# EAGLE design LED_Ansteuerung (EAGLE 5.09)

## Sheet 1 of 6
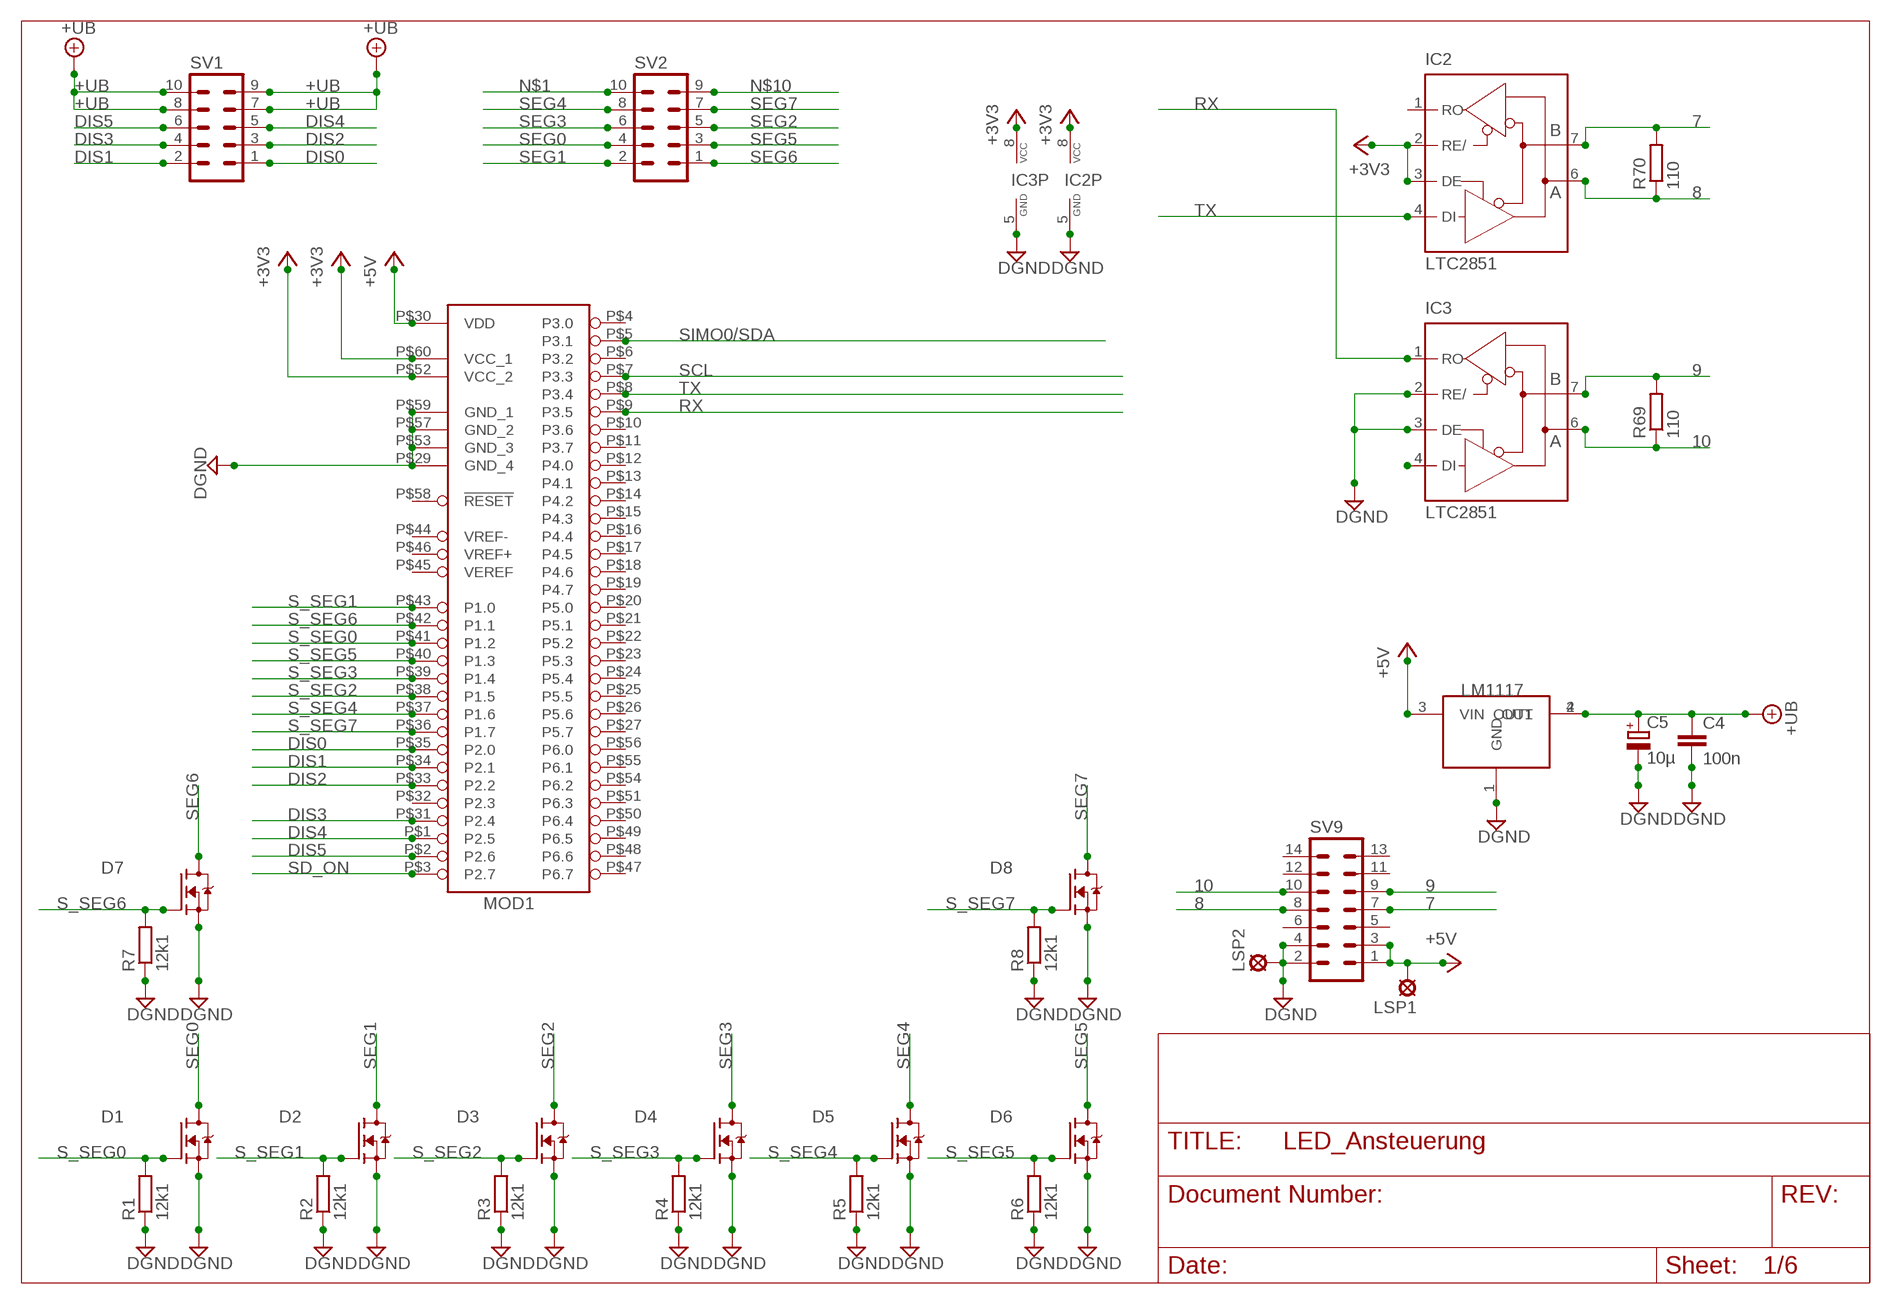
[diagram p0: schematic, sheet 1]

### Parts
C4  100n  C-EUC0805  [C0805]
C5  10µ  CPOL-EU153CLV-0505  [153CLV-0505]
D1  FDV303  [SOT23]
D2  FDV303  [SOT23]
D3  FDV303  [SOT23]
D4  FDV303  [SOT23]
D5  FDV303  [SOT23]
D6  FDV303  [SOT23]
D7  FDV303  [SOT23]
D8  FDV303  [SOT23]
IC1  LM1117  [SOT223]
IC2  LTC2851  MAX481CSA  [SO08]
IC3  LTC2851  MAX481CSA  [SO08]
LSP1  MCS10B  [MCS10B]
LSP2  MCS10B  [MCS10B]
MOD1  MOD_MSP430F16X  [MOD_MSDP430F16X]
R1  12k1  R-EU_R0805  [R0805]
R2  12k1  R-EU_R0805  [R0805]
R3  12k1  R-EU_R0805  [R0805]
R4  12k1  R-EU_R0805  [R0805]
R5  12k1  R-EU_R0805  [R0805]
R6  12k1  R-EU_R0805  [R0805]
R7  12k1  R-EU_R0805  [R0805]
R8  12k1  R-EU_R0805  [R0805]
R69  110  R-EU_R1206  [R1206]
R70  110  R-EU_R1206  [R1206]
SV1  ML10  [ML10]
SV2  ML10  [ML10]
SV9  ML14  [ML14]

### Nets
7: IC2.7(B) R70.2 SV9.7
8: IC2.6(A) R70.1 SV9.8
9: IC3.7(B) R69.2 SV9.9
10: IC3.6(A) R69.1 SV9.10
+3V3: IC2.2(RE/) IC2.3(DE) IC2.8(VCC) IC3.8(VCC) MOD1.P$52(VCC_2) MOD1.P$60(VCC_1) ; also sheet 2,3,4,5
+5V: IC1.3(VIN) LSP1.MP MOD1.P$30(VDD) SV9.1 SV9.3
+UB: C4.1 C5.+ IC1.2(OUT) IC1.4(OUT1) SV1.7 SV1.8 SV1.9 SV1.10
DGND: C4.2 C5.- D1.2(S) D2.2(S) D3.2(S) D4.2(S) D5.2(S) D6.2(S) D7.2(S) D8.2(S) IC1.1(GND) IC2.5(GND) IC3.2(RE/) IC3.3(DE) IC3.5(GND) LSP2.MP MOD1.P$29(GND_4) MOD1.P$53(GND_3) MOD1.P$57(GND_2) MOD1.P$59(GND_1) R1.1 R2.1 R3.1 R4.1 R5.1 R6.1 R7.1 R8.1 SV9.2 SV9.4 ; also sheet 2,3,4,5
DIS0: MOD1.P$35(P2.0) SV1.1
DIS1: MOD1.P$34(P2.1) SV1.2
DIS2: MOD1.P$33(P2.2) SV1.3
DIS3: MOD1.P$31(P2.4) SV1.4
DIS4: MOD1.P$1(P2.5) SV1.5
DIS5: MOD1.P$2(P2.6) SV1.6
N$1: SV2.10
N$10: SV2.9
N$35: IC3.4(DI)
RX: IC3.1(RO) MOD1.P$9(P3.5)
S_SEG0: D1.1(G) MOD1.P$41(P1.2) R1.2
S_SEG1: D2.1(G) MOD1.P$43(P1.0) R2.2
S_SEG2: D3.1(G) MOD1.P$38(P1.5) R3.2
S_SEG3: D4.1(G) MOD1.P$39(P1.4) R4.2
S_SEG4: D5.1(G) MOD1.P$37(P1.6) R5.2
S_SEG5: D6.1(G) MOD1.P$40(P1.3) R6.2
S_SEG6: D7.1(G) MOD1.P$42(P1.1) R7.2
S_SEG7: D8.1(G) MOD1.P$36(P1.7) R8.2
SCL: MOD1.P$7(P3.3) ; also sheet 2,3,4,5
SD_ON: MOD1.P$3(P2.7)
SEG0: D1.3(D) SV2.4
SEG1: D2.3(D) SV2.2
SEG2: D3.3(D) SV2.5
SEG3: D4.3(D) SV2.6
SEG4: D5.3(D) SV2.8
SEG5: D6.3(D) SV2.3
SEG6: D7.3(D) SV2.1
SEG7: D8.3(D) SV2.7
SIMO0/SDA: MOD1.P$5(P3.1) ; also sheet 2,3,4,5
TX: IC2.4(DI) MOD1.P$8(P3.4)
Unconnected: IC2.1(RO) MOD1.P$4(P3.0) MOD1.P$6(P3.2) MOD1.P$10(P3.6) MOD1.P$11(P3.7) MOD1.P$12(P4.0) MOD1.P$13(P4.1) MOD1.P$14(P4.2) MOD1.P$15(P4.3) MOD1.P$16(P4.4) MOD1.P$17(P4.5) MOD1.P$18(P4.6) MOD1.P$19(P4.7) MOD1.P$20(P5.0) MOD1.P$21(P5.1) MOD1.P$22(P5.2) MOD1.P$23(P5.3) MOD1.P$24(P5.4) MOD1.P$25(P5.5) MOD1.P$26(P5.6) MOD1.P$27(P5.7) MOD1.P$32(P2.3) MOD1.P$44(VREF-) MOD1.P$45(VEREF) MOD1.P$46(VREF+) MOD1.P$47(P6.7) MOD1.P$48(P6.6) MOD1.P$49(P6.5) MOD1.P$50(P6.4) MOD1.P$51(P6.3) MOD1.P$54(P6.2) MOD1.P$55(P6.1) MOD1.P$56(P6.0) MOD1.P$58(!RESET) SV9.5 SV9.6 SV9.11 SV9.12 SV9.13 SV9.14

## Sheet 2 of 6
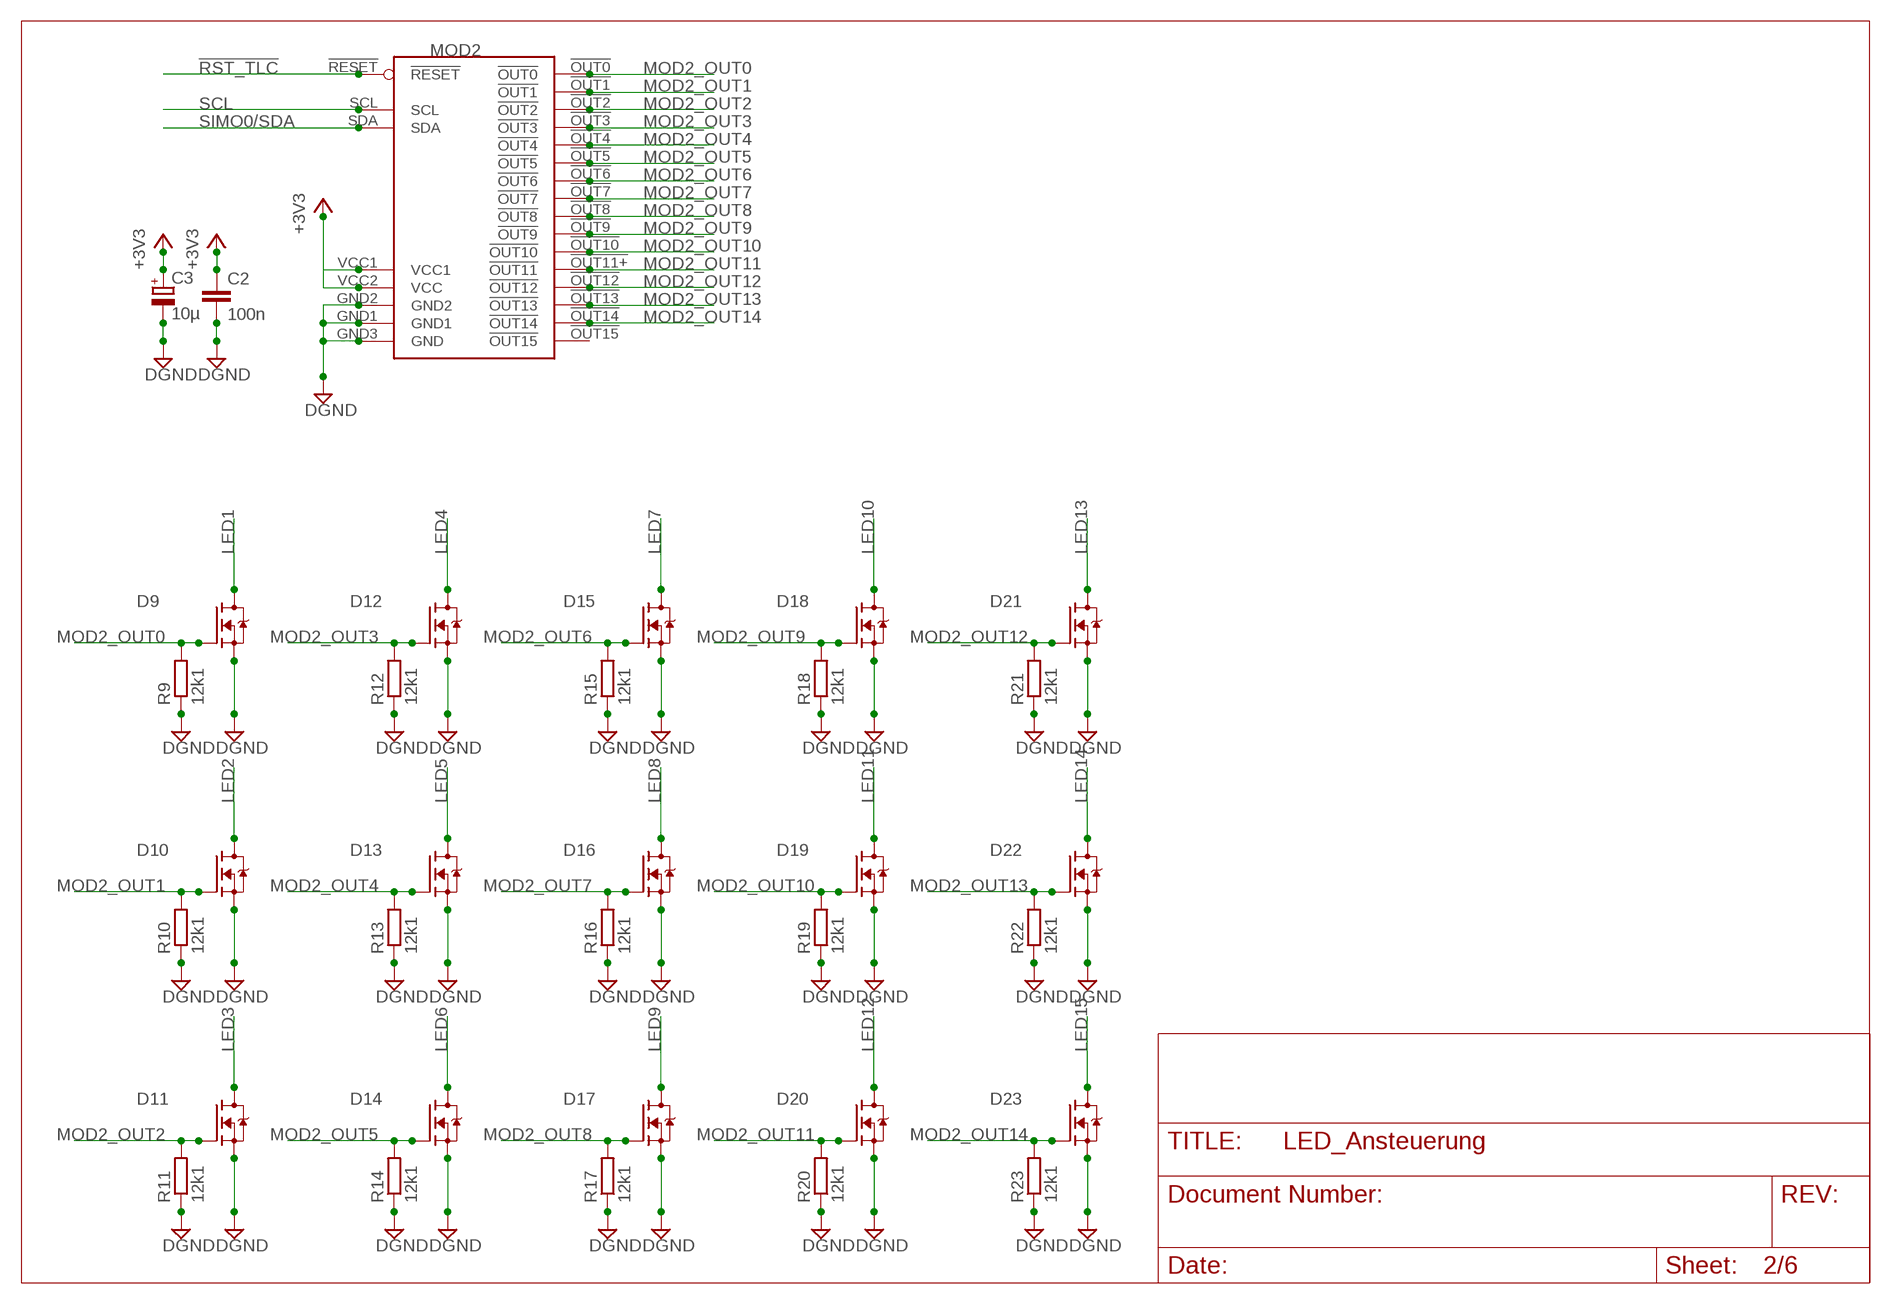
[diagram p1: schematic, sheet 2]

### Parts
C2  100n  C-EUC0805  [C0805]
C3  10µ  CPOL-EU153CLV-0505  [153CLV-0505]
D9  FDV303  [SOT23]
D10  FDV303  [SOT23]
D11  FDV303  [SOT23]
D12  FDV303  [SOT23]
D13  FDV303  [SOT23]
D14  FDV303  [SOT23]
D15  FDV303  [SOT23]
D16  FDV303  [SOT23]
D17  FDV303  [SOT23]
D18  FDV303  [SOT23]
D19  FDV303  [SOT23]
D20  FDV303  [SOT23]
D21  FDV303  [SOT23]
D22  FDV303  [SOT23]
D23  FDV303  [SOT23]
MOD2  TLC59116_MOD  [TLC59116_MOD]
R9  12k1  R-EU_R0805  [R0805]
R10  12k1  R-EU_R0805  [R0805]
R11  12k1  R-EU_R0805  [R0805]
R12  12k1  R-EU_R0805  [R0805]
R13  12k1  R-EU_R0805  [R0805]
R14  12k1  R-EU_R0805  [R0805]
R15  12k1  R-EU_R0805  [R0805]
R16  12k1  R-EU_R0805  [R0805]
R17  12k1  R-EU_R0805  [R0805]
R18  12k1  R-EU_R0805  [R0805]
R19  12k1  R-EU_R0805  [R0805]
R20  12k1  R-EU_R0805  [R0805]
R21  12k1  R-EU_R0805  [R0805]
R22  12k1  R-EU_R0805  [R0805]
R23  12k1  R-EU_R0805  [R0805]

### Nets
!RST_TLC: MOD2.!RESET ; also sheet 3,4,5
+3V3: C2.1 C3.+ MOD2.VCC1 MOD2.VCC2(VCC) ; also sheet 1,3,4,5
DGND: C2.2 C3.- D9.2(S) D10.2(S) D11.2(S) D12.2(S) D13.2(S) D14.2(S) D15.2(S) D16.2(S) D17.2(S) D18.2(S) D19.2(S) D20.2(S) D21.2(S) D22.2(S) D23.2(S) MOD2.GND1 MOD2.GND2 MOD2.GND3(GND) R9.1 R10.1 R11.1 R12.1 R13.1 R14.1 R15.1 R16.1 R17.1 R18.1 R19.1 R20.1 R21.1 R22.1 R23.1 ; also sheet 1,3,4,5
LED1: D9.3(D) ; also sheet 6
LED2: D10.3(D) ; also sheet 6
LED3: D11.3(D) ; also sheet 6
LED4: D12.3(D) ; also sheet 6
LED5: D13.3(D) ; also sheet 6
LED6: D14.3(D) ; also sheet 6
LED7: D15.3(D) ; also sheet 6
LED8: D16.3(D) ; also sheet 6
LED9: D17.3(D) ; also sheet 6
LED10: D18.3(D) ; also sheet 6
LED11: D19.3(D) ; also sheet 6
LED12: D20.3(D) ; also sheet 6
LED13: D21.3(D) ; also sheet 6
LED14: D22.3(D) ; also sheet 6
LED15: D23.3(D) ; also sheet 6
MOD2_OUT0: D9.1(G) MOD2.!OUT0 R9.2
MOD2_OUT1: D10.1(G) MOD2.!OUT1 R10.2
MOD2_OUT2: D11.1(G) MOD2.!OUT2 R11.2
MOD2_OUT3: D12.1(G) MOD2.!OUT3 R12.2
MOD2_OUT4: D13.1(G) MOD2.!OUT4 R13.2
MOD2_OUT5: D14.1(G) MOD2.!OUT5 R14.2
MOD2_OUT6: D15.1(G) MOD2.!OUT6 R15.2
MOD2_OUT7: D16.1(G) MOD2.!OUT7 R16.2
MOD2_OUT8: D17.1(G) MOD2.!OUT8 R17.2
MOD2_OUT9: D18.1(G) MOD2.!OUT9 R18.2
MOD2_OUT10: D19.1(G) MOD2.!OUT10 R19.2
MOD2_OUT11: D20.1(G) MOD2.!OUT11+(!OUT11) R20.2
MOD2_OUT12: D21.1(G) MOD2.!OUT12 R21.2
MOD2_OUT13: D22.1(G) MOD2.!OUT13 R22.2
MOD2_OUT14: D23.1(G) MOD2.!OUT14 R23.2
SCL: MOD2.SCL ; also sheet 1,3,4,5
SIMO0/SDA: MOD2.SDA ; also sheet 1,3,4,5
Unconnected: MOD2.!OUT15

## Sheet 3 of 6
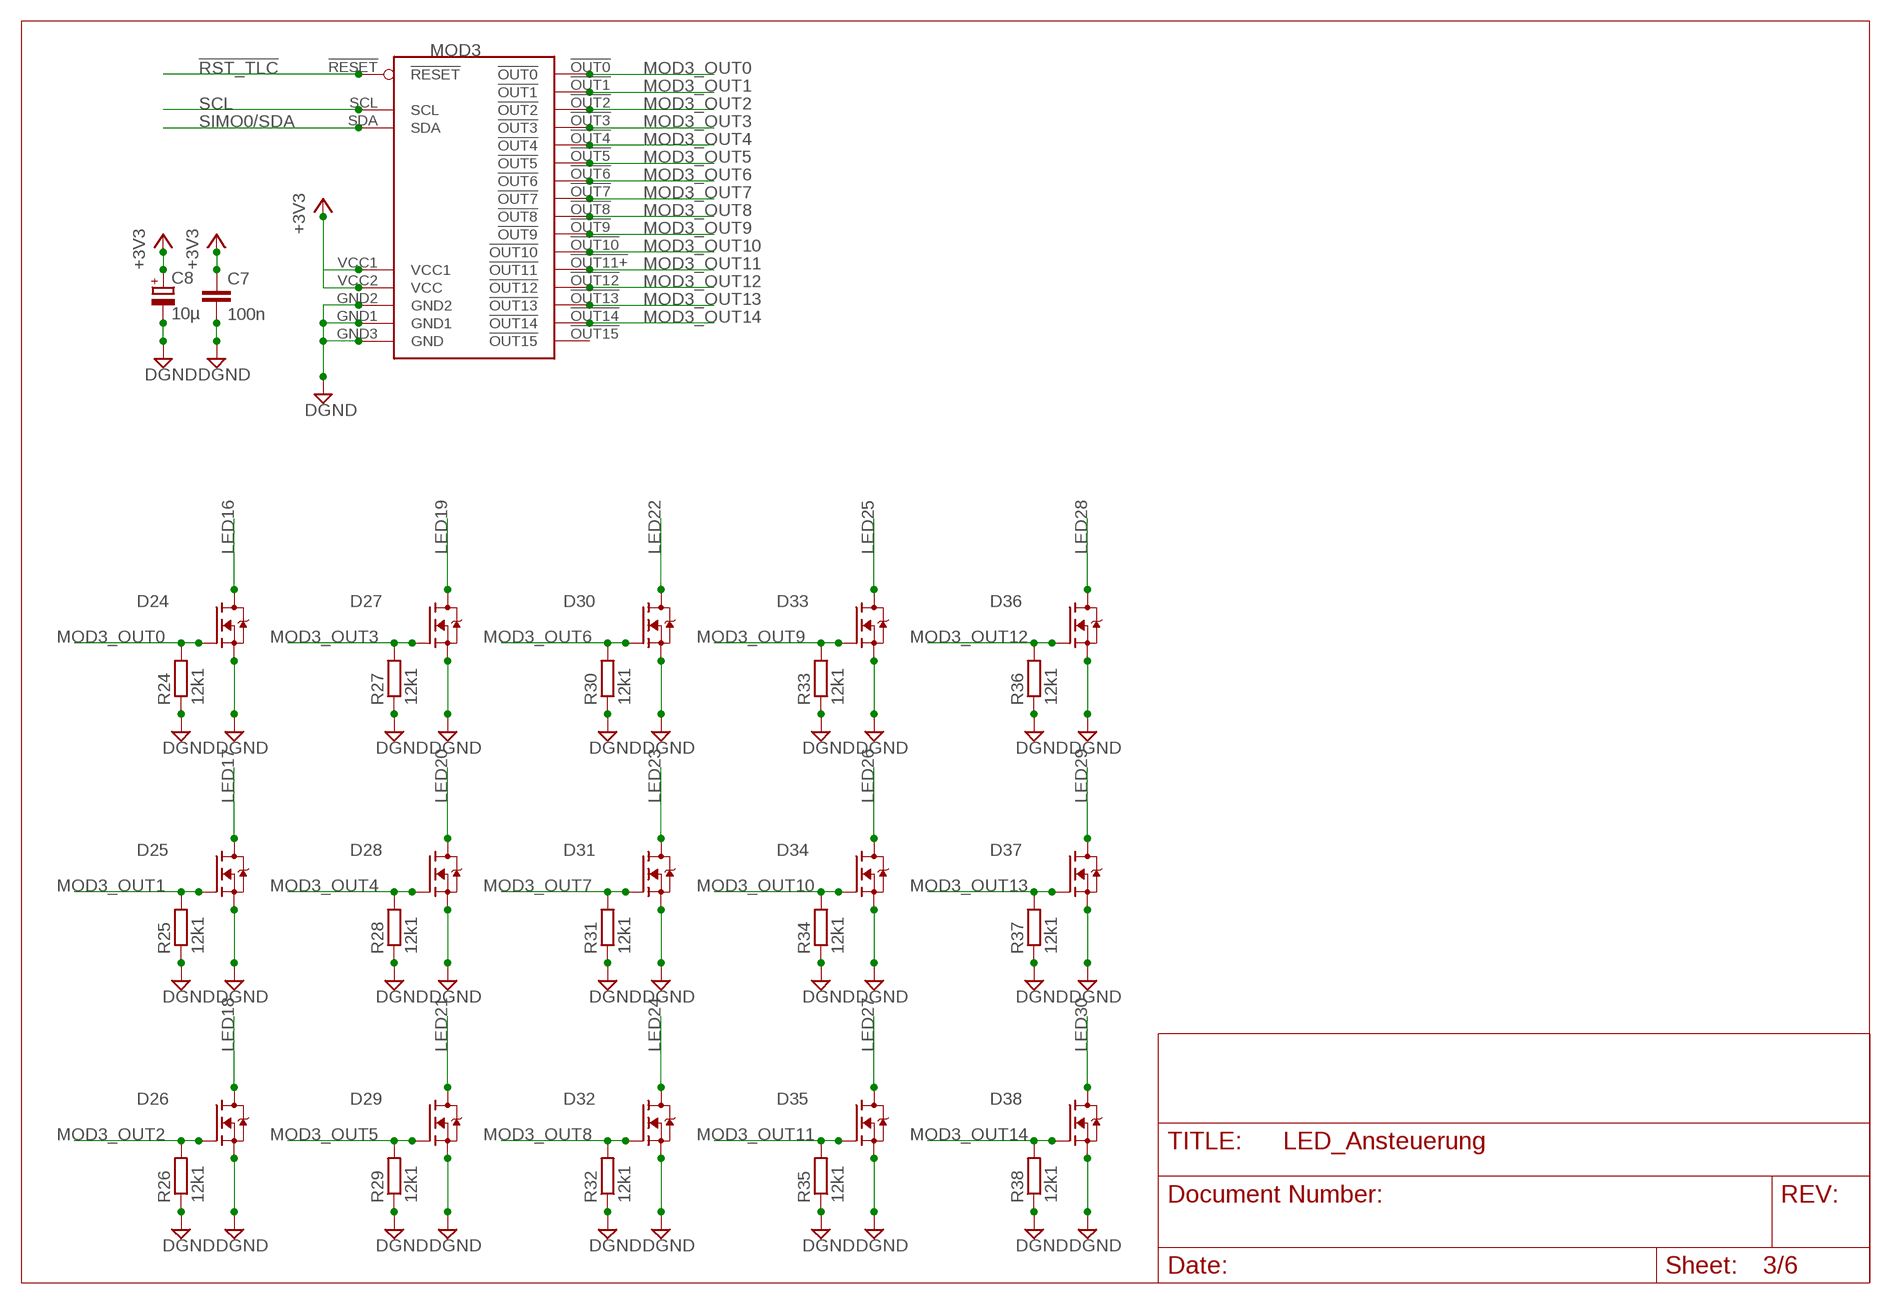
[diagram p2: schematic, sheet 3]

### Parts
C7  100n  C-EUC0805  [C0805]
C8  10µ  CPOL-EU153CLV-0505  [153CLV-0505]
D24  FDV303  [SOT23]
D25  FDV303  [SOT23]
D26  FDV303  [SOT23]
D27  FDV303  [SOT23]
D28  FDV303  [SOT23]
D29  FDV303  [SOT23]
D30  FDV303  [SOT23]
D31  FDV303  [SOT23]
D32  FDV303  [SOT23]
D33  FDV303  [SOT23]
D34  FDV303  [SOT23]
D35  FDV303  [SOT23]
D36  FDV303  [SOT23]
D37  FDV303  [SOT23]
D38  FDV303  [SOT23]
MOD3  TLC59116_MOD  [TLC59116_MOD]
R24  12k1  R-EU_R0805  [R0805]
R25  12k1  R-EU_R0805  [R0805]
R26  12k1  R-EU_R0805  [R0805]
R27  12k1  R-EU_R0805  [R0805]
R28  12k1  R-EU_R0805  [R0805]
R29  12k1  R-EU_R0805  [R0805]
R30  12k1  R-EU_R0805  [R0805]
R31  12k1  R-EU_R0805  [R0805]
R32  12k1  R-EU_R0805  [R0805]
R33  12k1  R-EU_R0805  [R0805]
R34  12k1  R-EU_R0805  [R0805]
R35  12k1  R-EU_R0805  [R0805]
R36  12k1  R-EU_R0805  [R0805]
R37  12k1  R-EU_R0805  [R0805]
R38  12k1  R-EU_R0805  [R0805]

### Nets
!RST_TLC: MOD3.!RESET ; also sheet 2,4,5
+3V3: C7.1 C8.+ MOD3.VCC1 MOD3.VCC2(VCC) ; also sheet 1,2,4,5
DGND: C7.2 C8.- D24.2(S) D25.2(S) D26.2(S) D27.2(S) D28.2(S) D29.2(S) D30.2(S) D31.2(S) D32.2(S) D33.2(S) D34.2(S) D35.2(S) D36.2(S) D37.2(S) D38.2(S) MOD3.GND1 MOD3.GND2 MOD3.GND3(GND) R24.1 R25.1 R26.1 R27.1 R28.1 R29.1 R30.1 R31.1 R32.1 R33.1 R34.1 R35.1 R36.1 R37.1 R38.1 ; also sheet 1,2,4,5
LED16: D24.3(D) ; also sheet 6
LED17: D25.3(D) ; also sheet 6
LED18: D26.3(D) ; also sheet 6
LED19: D27.3(D) ; also sheet 6
LED20: D28.3(D) ; also sheet 6
LED21: D29.3(D) ; also sheet 6
LED22: D30.3(D) ; also sheet 6
LED23: D31.3(D) ; also sheet 6
LED24: D32.3(D) ; also sheet 6
LED25: D33.3(D) ; also sheet 6
LED26: D34.3(D) ; also sheet 6
LED27: D35.3(D) ; also sheet 6
LED28: D36.3(D) ; also sheet 6
LED29: D37.3(D) ; also sheet 6
LED30: D38.3(D) ; also sheet 6
MOD3_OUT0: D24.1(G) MOD3.!OUT0 R24.2
MOD3_OUT1: D25.1(G) MOD3.!OUT1 R25.2
MOD3_OUT2: D26.1(G) MOD3.!OUT2 R26.2
MOD3_OUT3: D27.1(G) MOD3.!OUT3 R27.2
MOD3_OUT4: D28.1(G) MOD3.!OUT4 R28.2
MOD3_OUT5: D29.1(G) MOD3.!OUT5 R29.2
MOD3_OUT6: D30.1(G) MOD3.!OUT6 R30.2
MOD3_OUT7: D31.1(G) MOD3.!OUT7 R31.2
MOD3_OUT8: D32.1(G) MOD3.!OUT8 R32.2
MOD3_OUT9: D33.1(G) MOD3.!OUT9 R33.2
MOD3_OUT10: D34.1(G) MOD3.!OUT10 R34.2
MOD3_OUT11: D35.1(G) MOD3.!OUT11+(!OUT11) R35.2
MOD3_OUT12: D36.1(G) MOD3.!OUT12 R36.2
MOD3_OUT13: D37.1(G) MOD3.!OUT13 R37.2
MOD3_OUT14: D38.1(G) MOD3.!OUT14 R38.2
SCL: MOD3.SCL ; also sheet 1,2,4,5
SIMO0/SDA: MOD3.SDA ; also sheet 1,2,4,5
Unconnected: MOD3.!OUT15

## Sheet 4 of 6
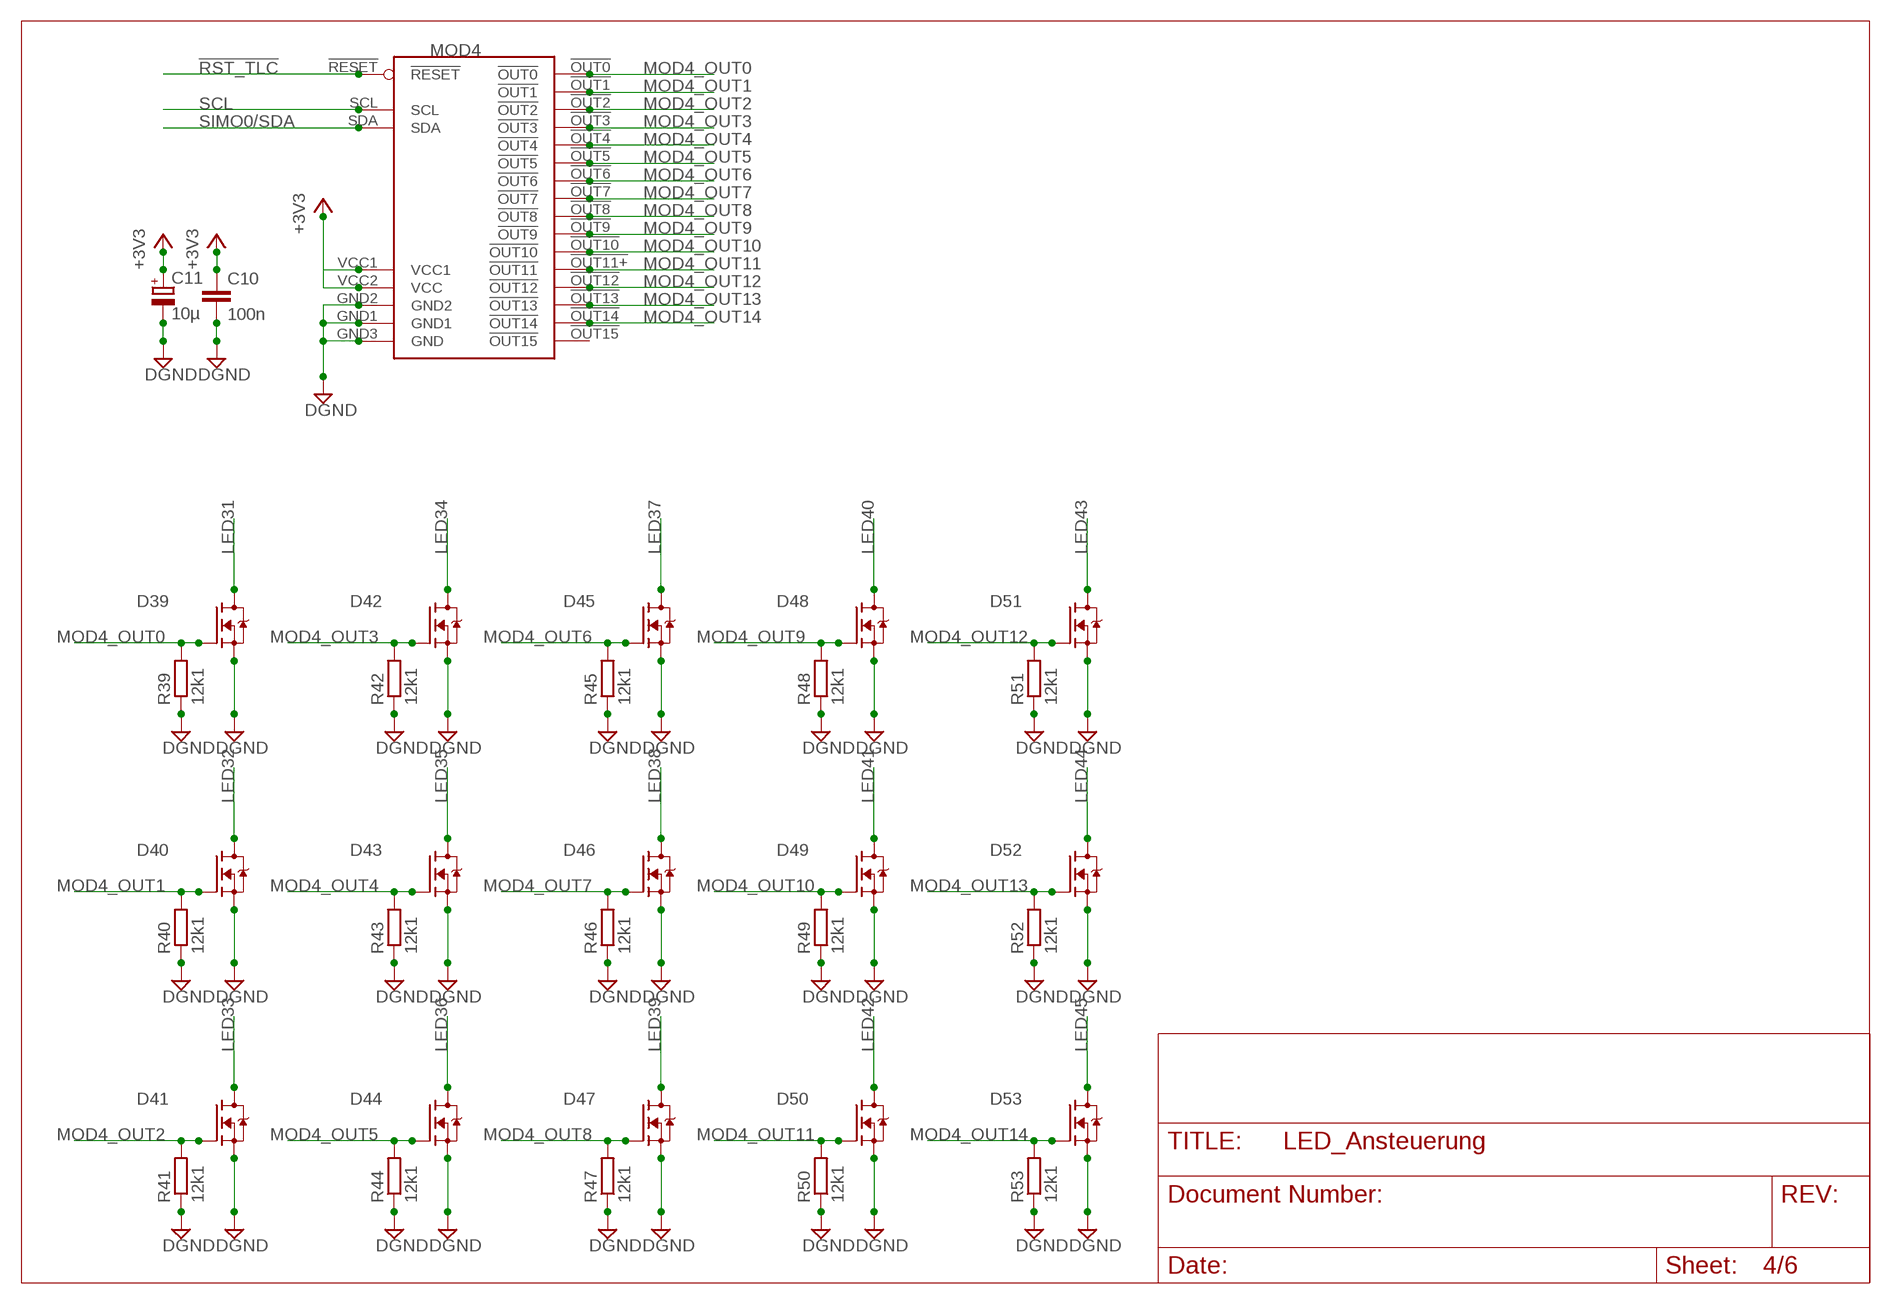
[diagram p3: schematic, sheet 4]

### Parts
C10  100n  C-EUC0805  [C0805]
C11  10µ  CPOL-EU153CLV-0505  [153CLV-0505]
D39  FDV303  [SOT23]
D40  FDV303  [SOT23]
D41  FDV303  [SOT23]
D42  FDV303  [SOT23]
D43  FDV303  [SOT23]
D44  FDV303  [SOT23]
D45  FDV303  [SOT23]
D46  FDV303  [SOT23]
D47  FDV303  [SOT23]
D48  FDV303  [SOT23]
D49  FDV303  [SOT23]
D50  FDV303  [SOT23]
D51  FDV303  [SOT23]
D52  FDV303  [SOT23]
D53  FDV303  [SOT23]
MOD4  TLC59116_MOD  [TLC59116_MOD]
R39  12k1  R-EU_R0805  [R0805]
R40  12k1  R-EU_R0805  [R0805]
R41  12k1  R-EU_R0805  [R0805]
R42  12k1  R-EU_R0805  [R0805]
R43  12k1  R-EU_R0805  [R0805]
R44  12k1  R-EU_R0805  [R0805]
R45  12k1  R-EU_R0805  [R0805]
R46  12k1  R-EU_R0805  [R0805]
R47  12k1  R-EU_R0805  [R0805]
R48  12k1  R-EU_R0805  [R0805]
R49  12k1  R-EU_R0805  [R0805]
R50  12k1  R-EU_R0805  [R0805]
R51  12k1  R-EU_R0805  [R0805]
R52  12k1  R-EU_R0805  [R0805]
R53  12k1  R-EU_R0805  [R0805]

### Nets
!RST_TLC: MOD4.!RESET ; also sheet 2,3,5
+3V3: C10.1 C11.+ MOD4.VCC1 MOD4.VCC2(VCC) ; also sheet 1,2,3,5
DGND: C10.2 C11.- D39.2(S) D40.2(S) D41.2(S) D42.2(S) D43.2(S) D44.2(S) D45.2(S) D46.2(S) D47.2(S) D48.2(S) D49.2(S) D50.2(S) D51.2(S) D52.2(S) D53.2(S) MOD4.GND1 MOD4.GND2 MOD4.GND3(GND) R39.1 R40.1 R41.1 R42.1 R43.1 R44.1 R45.1 R46.1 R47.1 R48.1 R49.1 R50.1 R51.1 R52.1 R53.1 ; also sheet 1,2,3,5
LED31: D39.3(D) ; also sheet 6
LED32: D40.3(D) ; also sheet 6
LED33: D41.3(D) ; also sheet 6
LED34: D42.3(D) ; also sheet 6
LED35: D43.3(D) ; also sheet 6
LED36: D44.3(D) ; also sheet 6
LED37: D45.3(D) ; also sheet 6
LED38: D46.3(D) ; also sheet 6
LED39: D47.3(D) ; also sheet 6
LED40: D48.3(D) ; also sheet 6
LED41: D49.3(D) ; also sheet 6
LED42: D50.3(D) ; also sheet 6
LED43: D51.3(D) ; also sheet 6
LED44: D52.3(D) ; also sheet 6
LED45: D53.3(D) ; also sheet 6
MOD4_OUT0: D39.1(G) MOD4.!OUT0 R39.2
MOD4_OUT1: D40.1(G) MOD4.!OUT1 R40.2
MOD4_OUT2: D41.1(G) MOD4.!OUT2 R41.2
MOD4_OUT3: D42.1(G) MOD4.!OUT3 R42.2
MOD4_OUT4: D43.1(G) MOD4.!OUT4 R43.2
MOD4_OUT5: D44.1(G) MOD4.!OUT5 R44.2
MOD4_OUT6: D45.1(G) MOD4.!OUT6 R45.2
MOD4_OUT7: D46.1(G) MOD4.!OUT7 R46.2
MOD4_OUT8: D47.1(G) MOD4.!OUT8 R47.2
MOD4_OUT9: D48.1(G) MOD4.!OUT9 R48.2
MOD4_OUT10: D49.1(G) MOD4.!OUT10 R49.2
MOD4_OUT11: D50.1(G) MOD4.!OUT11+(!OUT11) R50.2
MOD4_OUT12: D51.1(G) MOD4.!OUT12 R51.2
MOD4_OUT13: D52.1(G) MOD4.!OUT13 R52.2
MOD4_OUT14: D53.1(G) MOD4.!OUT14 R53.2
SCL: MOD4.SCL ; also sheet 1,2,3,5
SIMO0/SDA: MOD4.SDA ; also sheet 1,2,3,5
Unconnected: MOD4.!OUT15

## Sheet 5 of 6
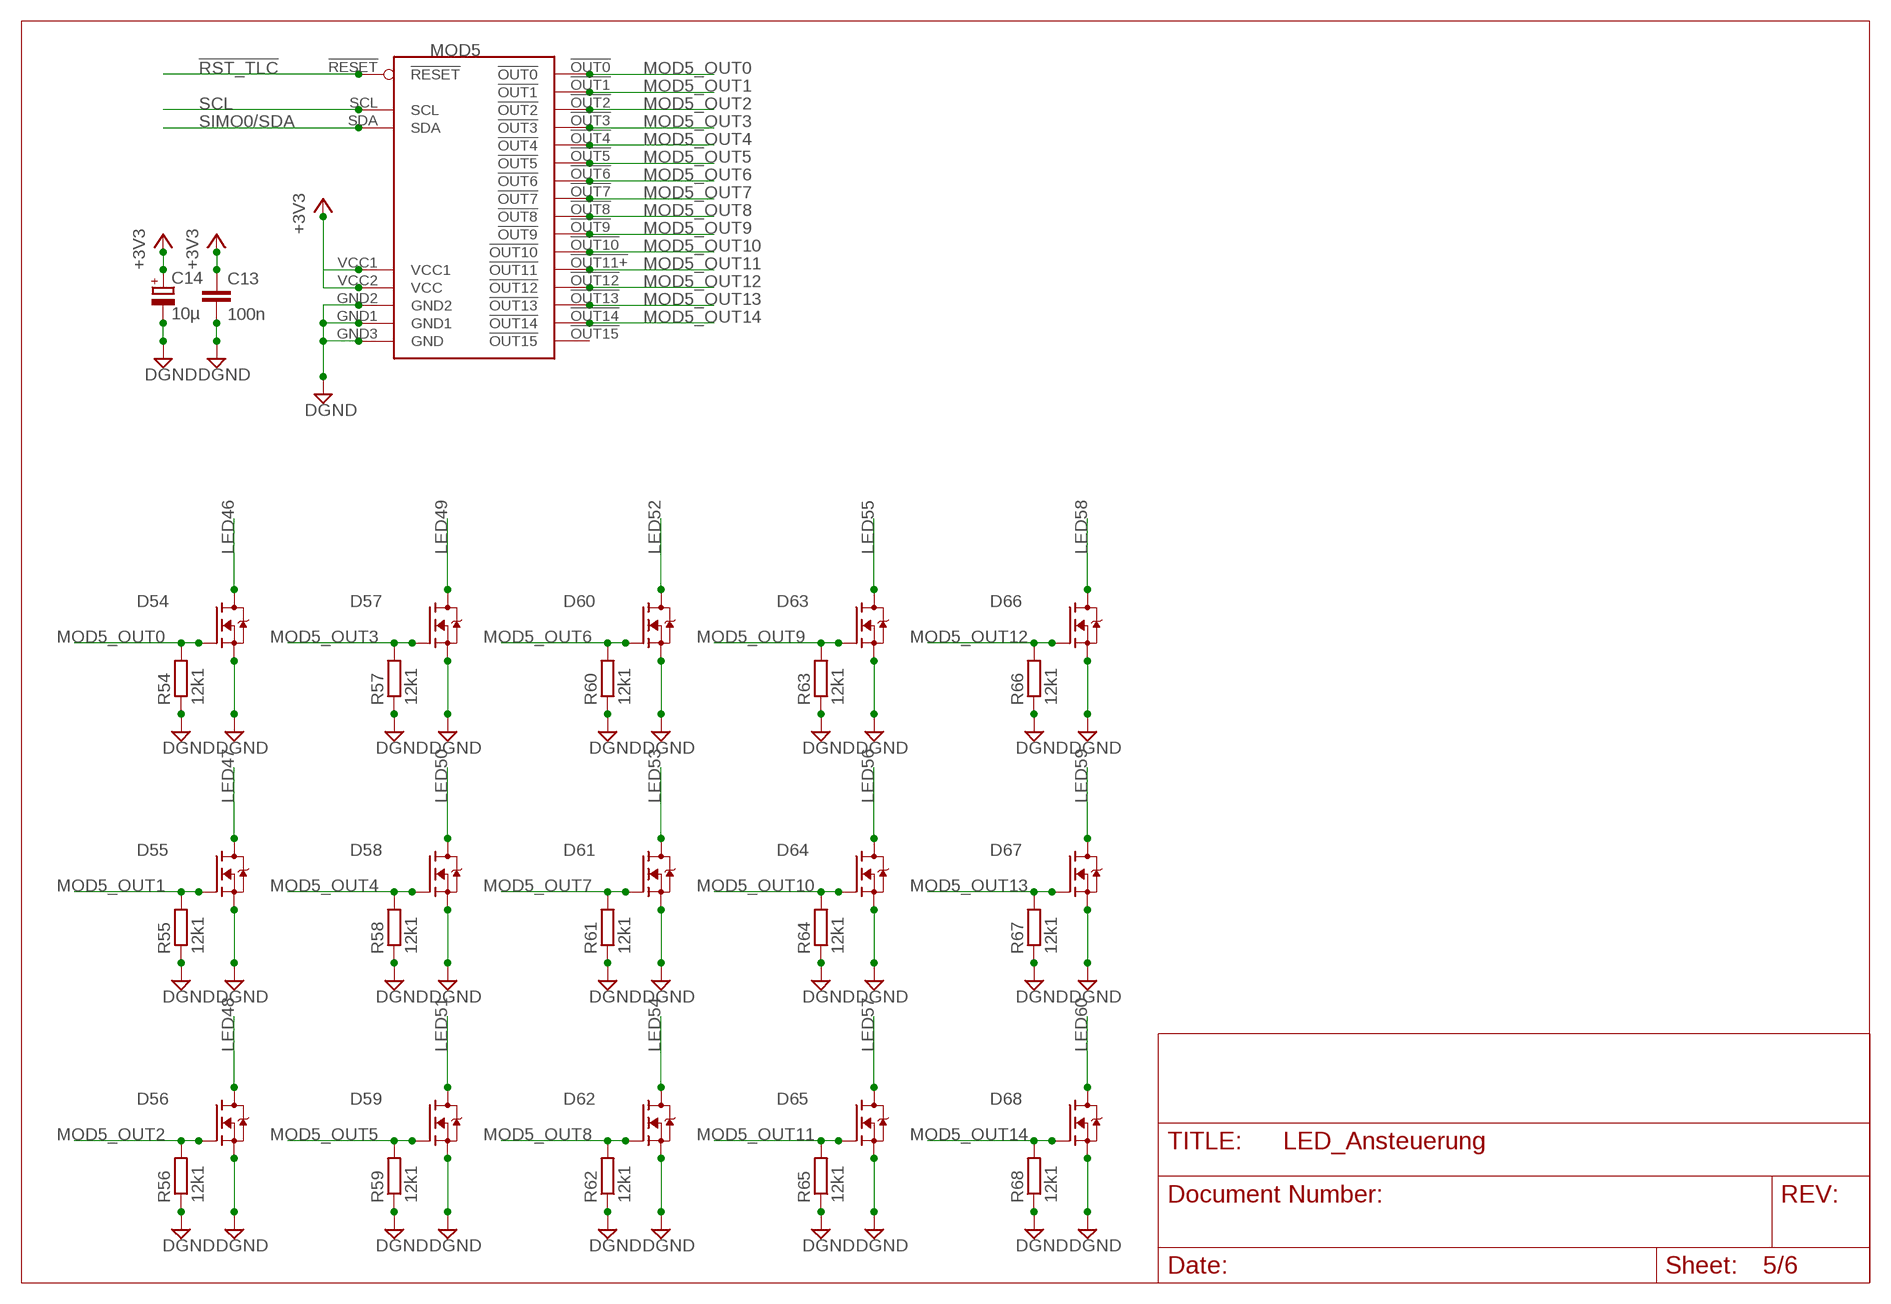
[diagram p4: schematic, sheet 5]

### Parts
C13  100n  C-EUC0805  [C0805]
C14  10µ  CPOL-EU153CLV-0505  [153CLV-0505]
D54  FDV303  [SOT23]
D55  FDV303  [SOT23]
D56  FDV303  [SOT23]
D57  FDV303  [SOT23]
D58  FDV303  [SOT23]
D59  FDV303  [SOT23]
D60  FDV303  [SOT23]
D61  FDV303  [SOT23]
D62  FDV303  [SOT23]
D63  FDV303  [SOT23]
D64  FDV303  [SOT23]
D65  FDV303  [SOT23]
D66  FDV303  [SOT23]
D67  FDV303  [SOT23]
D68  FDV303  [SOT23]
MOD5  TLC59116_MOD  [TLC59116_MOD]
R54  12k1  R-EU_R0805  [R0805]
R55  12k1  R-EU_R0805  [R0805]
R56  12k1  R-EU_R0805  [R0805]
R57  12k1  R-EU_R0805  [R0805]
R58  12k1  R-EU_R0805  [R0805]
R59  12k1  R-EU_R0805  [R0805]
R60  12k1  R-EU_R0805  [R0805]
R61  12k1  R-EU_R0805  [R0805]
R62  12k1  R-EU_R0805  [R0805]
R63  12k1  R-EU_R0805  [R0805]
R64  12k1  R-EU_R0805  [R0805]
R65  12k1  R-EU_R0805  [R0805]
R66  12k1  R-EU_R0805  [R0805]
R67  12k1  R-EU_R0805  [R0805]
R68  12k1  R-EU_R0805  [R0805]

### Nets
!RST_TLC: MOD5.!RESET ; also sheet 2,3,4
+3V3: C13.1 C14.+ MOD5.VCC1 MOD5.VCC2(VCC) ; also sheet 1,2,3,4
DGND: C13.2 C14.- D54.2(S) D55.2(S) D56.2(S) D57.2(S) D58.2(S) D59.2(S) D60.2(S) D61.2(S) D62.2(S) D63.2(S) D64.2(S) D65.2(S) D66.2(S) D67.2(S) D68.2(S) MOD5.GND1 MOD5.GND2 MOD5.GND3(GND) R54.1 R55.1 R56.1 R57.1 R58.1 R59.1 R60.1 R61.1 R62.1 R63.1 R64.1 R65.1 R66.1 R67.1 R68.1 ; also sheet 1,2,3,4
LED46: D54.3(D) ; also sheet 6
LED47: D55.3(D) ; also sheet 6
LED48: D56.3(D) ; also sheet 6
LED49: D57.3(D) ; also sheet 6
LED50: D58.3(D) ; also sheet 6
LED51: D59.3(D) ; also sheet 6
LED52: D60.3(D) ; also sheet 6
LED53: D61.3(D) ; also sheet 6
LED54: D62.3(D) ; also sheet 6
LED55: D63.3(D) ; also sheet 6
LED56: D64.3(D) ; also sheet 6
LED57: D65.3(D) ; also sheet 6
LED58: D66.3(D) ; also sheet 6
LED59: D67.3(D) ; also sheet 6
LED60: D68.3(D) ; also sheet 6
MOD5_OUT0: D54.1(G) MOD5.!OUT0 R54.2
MOD5_OUT1: D55.1(G) MOD5.!OUT1 R55.2
MOD5_OUT2: D56.1(G) MOD5.!OUT2 R56.2
MOD5_OUT3: D57.1(G) MOD5.!OUT3 R57.2
MOD5_OUT4: D58.1(G) MOD5.!OUT4 R58.2
MOD5_OUT5: D59.1(G) MOD5.!OUT5 R59.2
MOD5_OUT6: D60.1(G) MOD5.!OUT6 R60.2
MOD5_OUT7: D61.1(G) MOD5.!OUT7 R61.2
MOD5_OUT8: D62.1(G) MOD5.!OUT8 R62.2
MOD5_OUT9: D63.1(G) MOD5.!OUT9 R63.2
MOD5_OUT10: D64.1(G) MOD5.!OUT10 R64.2
MOD5_OUT11: D65.1(G) MOD5.!OUT11+(!OUT11) R65.2
MOD5_OUT12: D66.1(G) MOD5.!OUT12 R66.2
MOD5_OUT13: D67.1(G) MOD5.!OUT13 R67.2
MOD5_OUT14: D68.1(G) MOD5.!OUT14 R68.2
SCL: MOD5.SCL ; also sheet 1,2,3,4
SIMO0/SDA: MOD5.SDA ; also sheet 1,2,3,4
Unconnected: MOD5.!OUT15

## Sheet 6 of 6
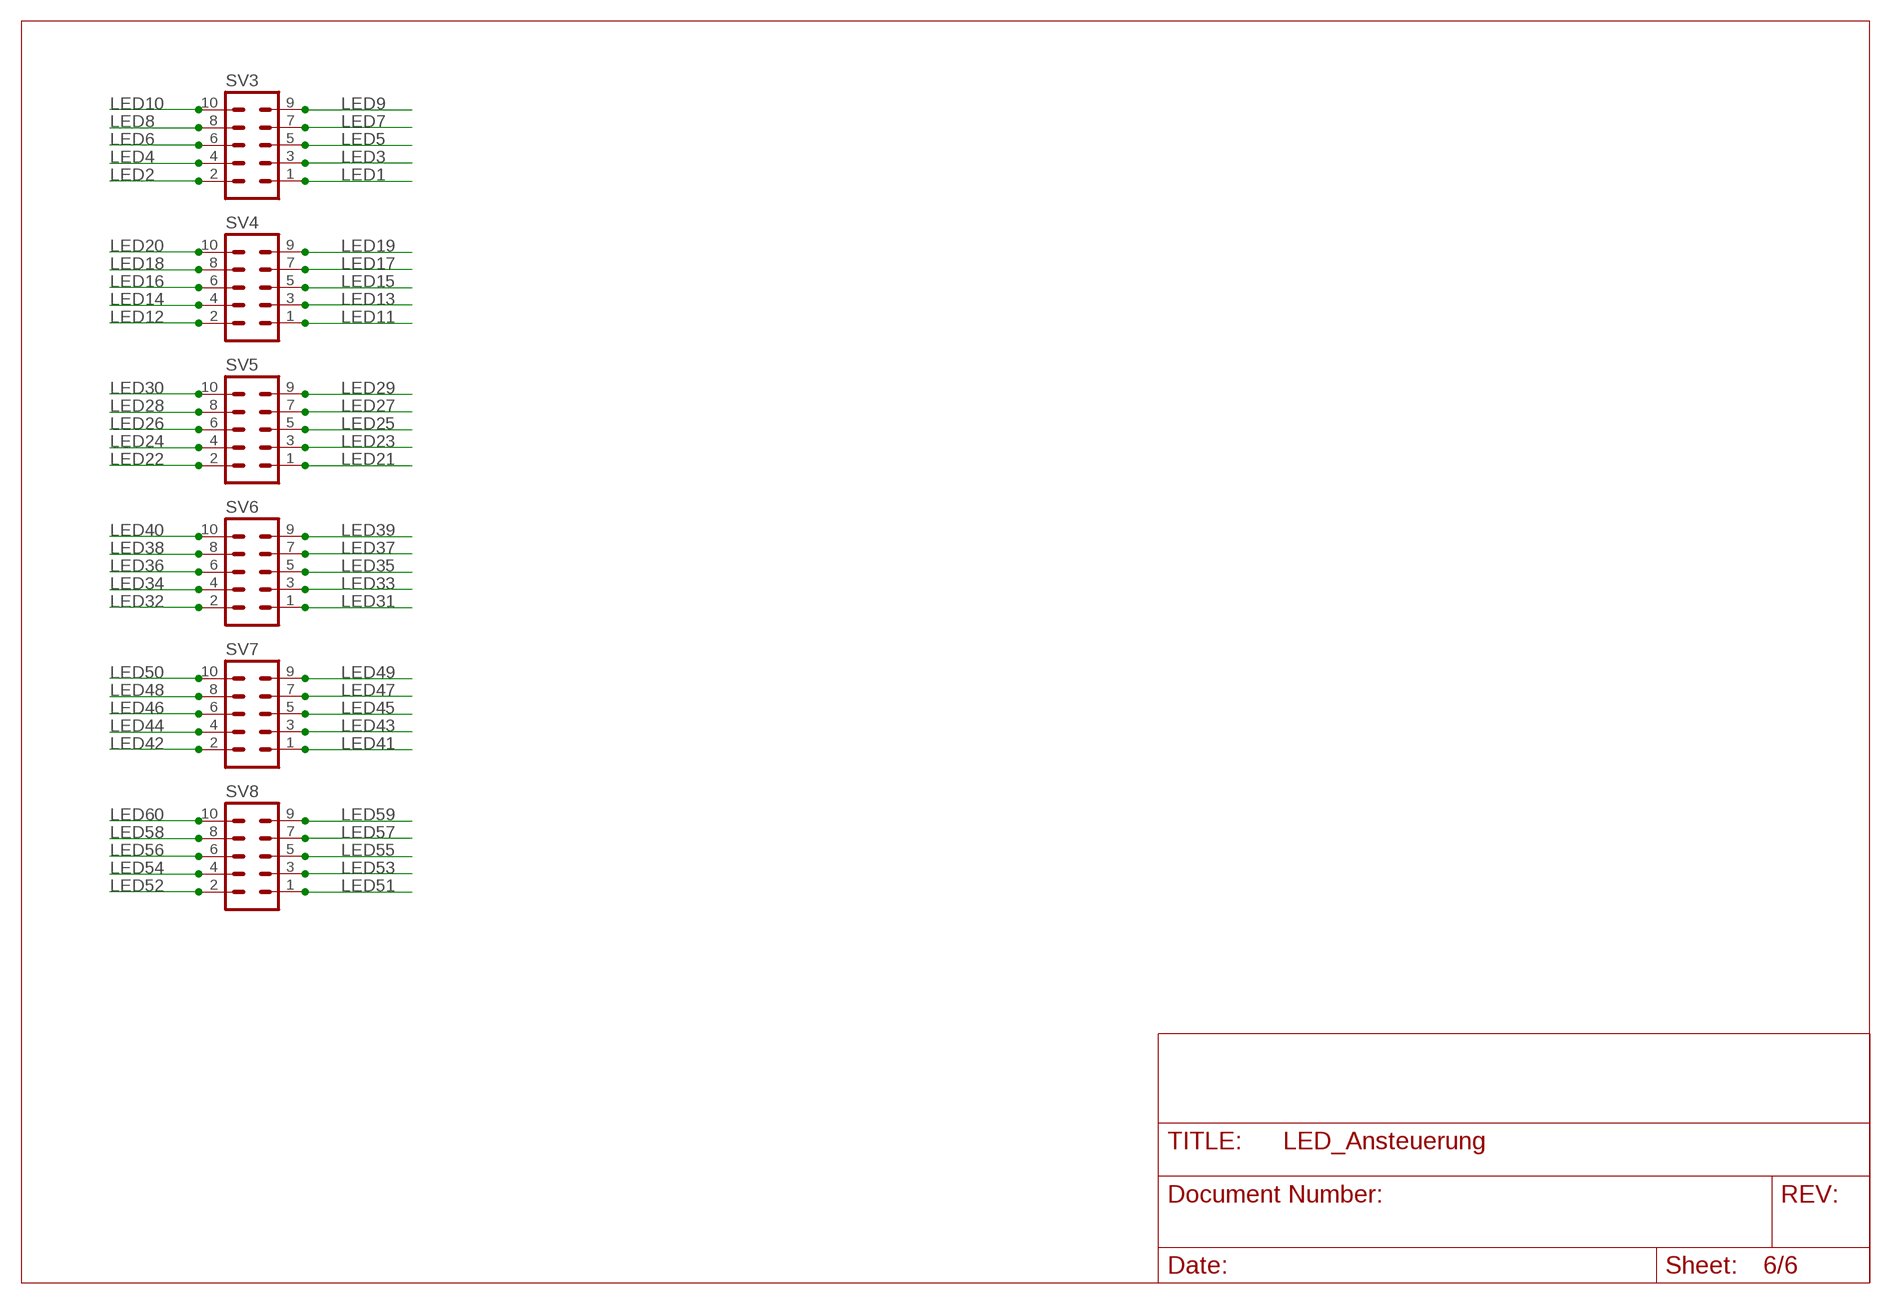
[diagram p5: schematic, sheet 6]

### Parts
SV3  ML10  [ML10]
SV4  ML10  [ML10]
SV5  ML10  [ML10]
SV6  ML10  [ML10]
SV7  ML10  [ML10]
SV8  ML10  [ML10]

### Nets
LED1: SV3.1 ; also sheet 2
LED2: SV3.2 ; also sheet 2
LED3: SV3.3 ; also sheet 2
LED4: SV3.4 ; also sheet 2
LED5: SV3.5 ; also sheet 2
LED6: SV3.6 ; also sheet 2
LED7: SV3.7 ; also sheet 2
LED8: SV3.8 ; also sheet 2
LED9: SV3.9 ; also sheet 2
LED10: SV3.10 ; also sheet 2
LED11: SV4.1 ; also sheet 2
LED12: SV4.2 ; also sheet 2
LED13: SV4.3 ; also sheet 2
LED14: SV4.4 ; also sheet 2
LED15: SV4.5 ; also sheet 2
LED16: SV4.6 ; also sheet 3
LED17: SV4.7 ; also sheet 3
LED18: SV4.8 ; also sheet 3
LED19: SV4.9 ; also sheet 3
LED20: SV4.10 ; also sheet 3
LED21: SV5.1 ; also sheet 3
LED22: SV5.2 ; also sheet 3
LED23: SV5.3 ; also sheet 3
LED24: SV5.4 ; also sheet 3
LED25: SV5.5 ; also sheet 3
LED26: SV5.6 ; also sheet 3
LED27: SV5.7 ; also sheet 3
LED28: SV5.8 ; also sheet 3
LED29: SV5.9 ; also sheet 3
LED30: SV5.10 ; also sheet 3
LED31: SV6.1 ; also sheet 4
LED32: SV6.2 ; also sheet 4
LED33: SV6.3 ; also sheet 4
LED34: SV6.4 ; also sheet 4
LED35: SV6.5 ; also sheet 4
LED36: SV6.6 ; also sheet 4
LED37: SV6.7 ; also sheet 4
LED38: SV6.8 ; also sheet 4
LED39: SV6.9 ; also sheet 4
LED40: SV6.10 ; also sheet 4
LED41: SV7.1 ; also sheet 4
LED42: SV7.2 ; also sheet 4
LED43: SV7.3 ; also sheet 4
LED44: SV7.4 ; also sheet 4
LED45: SV7.5 ; also sheet 4
LED46: SV7.6 ; also sheet 5
LED47: SV7.7 ; also sheet 5
LED48: SV7.8 ; also sheet 5
LED49: SV7.9 ; also sheet 5
LED50: SV7.10 ; also sheet 5
LED51: SV8.1 ; also sheet 5
LED52: SV8.2 ; also sheet 5
LED53: SV8.3 ; also sheet 5
LED54: SV8.4 ; also sheet 5
LED55: SV8.5 ; also sheet 5
LED56: SV8.6 ; also sheet 5
LED57: SV8.7 ; also sheet 5
LED58: SV8.8 ; also sheet 5
LED59: SV8.9 ; also sheet 5
LED60: SV8.10 ; also sheet 5

## Library data of the parts
C2 C4 C7 C10 C13 = rcl:C-EU: CAPACITOR, European symbol
C3 C5 C8 C11 C14 = rcl:CPOL-EU: POLARIZED CAPACITOR, European symbol
D1-D68 = transistor-fet:FDV303
IC1 = national-2:LM1117
IC2 IC3 = maxim:MAX481CSA: RS485 TRANSEIVER
LSP1 LSP2 = solpad:MCS10B: SOLDER PAD MC S1, distributor Buerklin, 15F505
MOD1 = extra_dev:MOD_MSP430F16X
MOD2-MOD5 = extra_dev:TLC59116_MOD
R1-R70 = rcl:R-EU_: RESISTOR, European symbol
SV1-SV8 = con-harting-ml:ML10: HARTING
SV9 = con-harting-ml:ML14: HARTING

## Net classes
0 default: clearance 0.25 mm

## Board
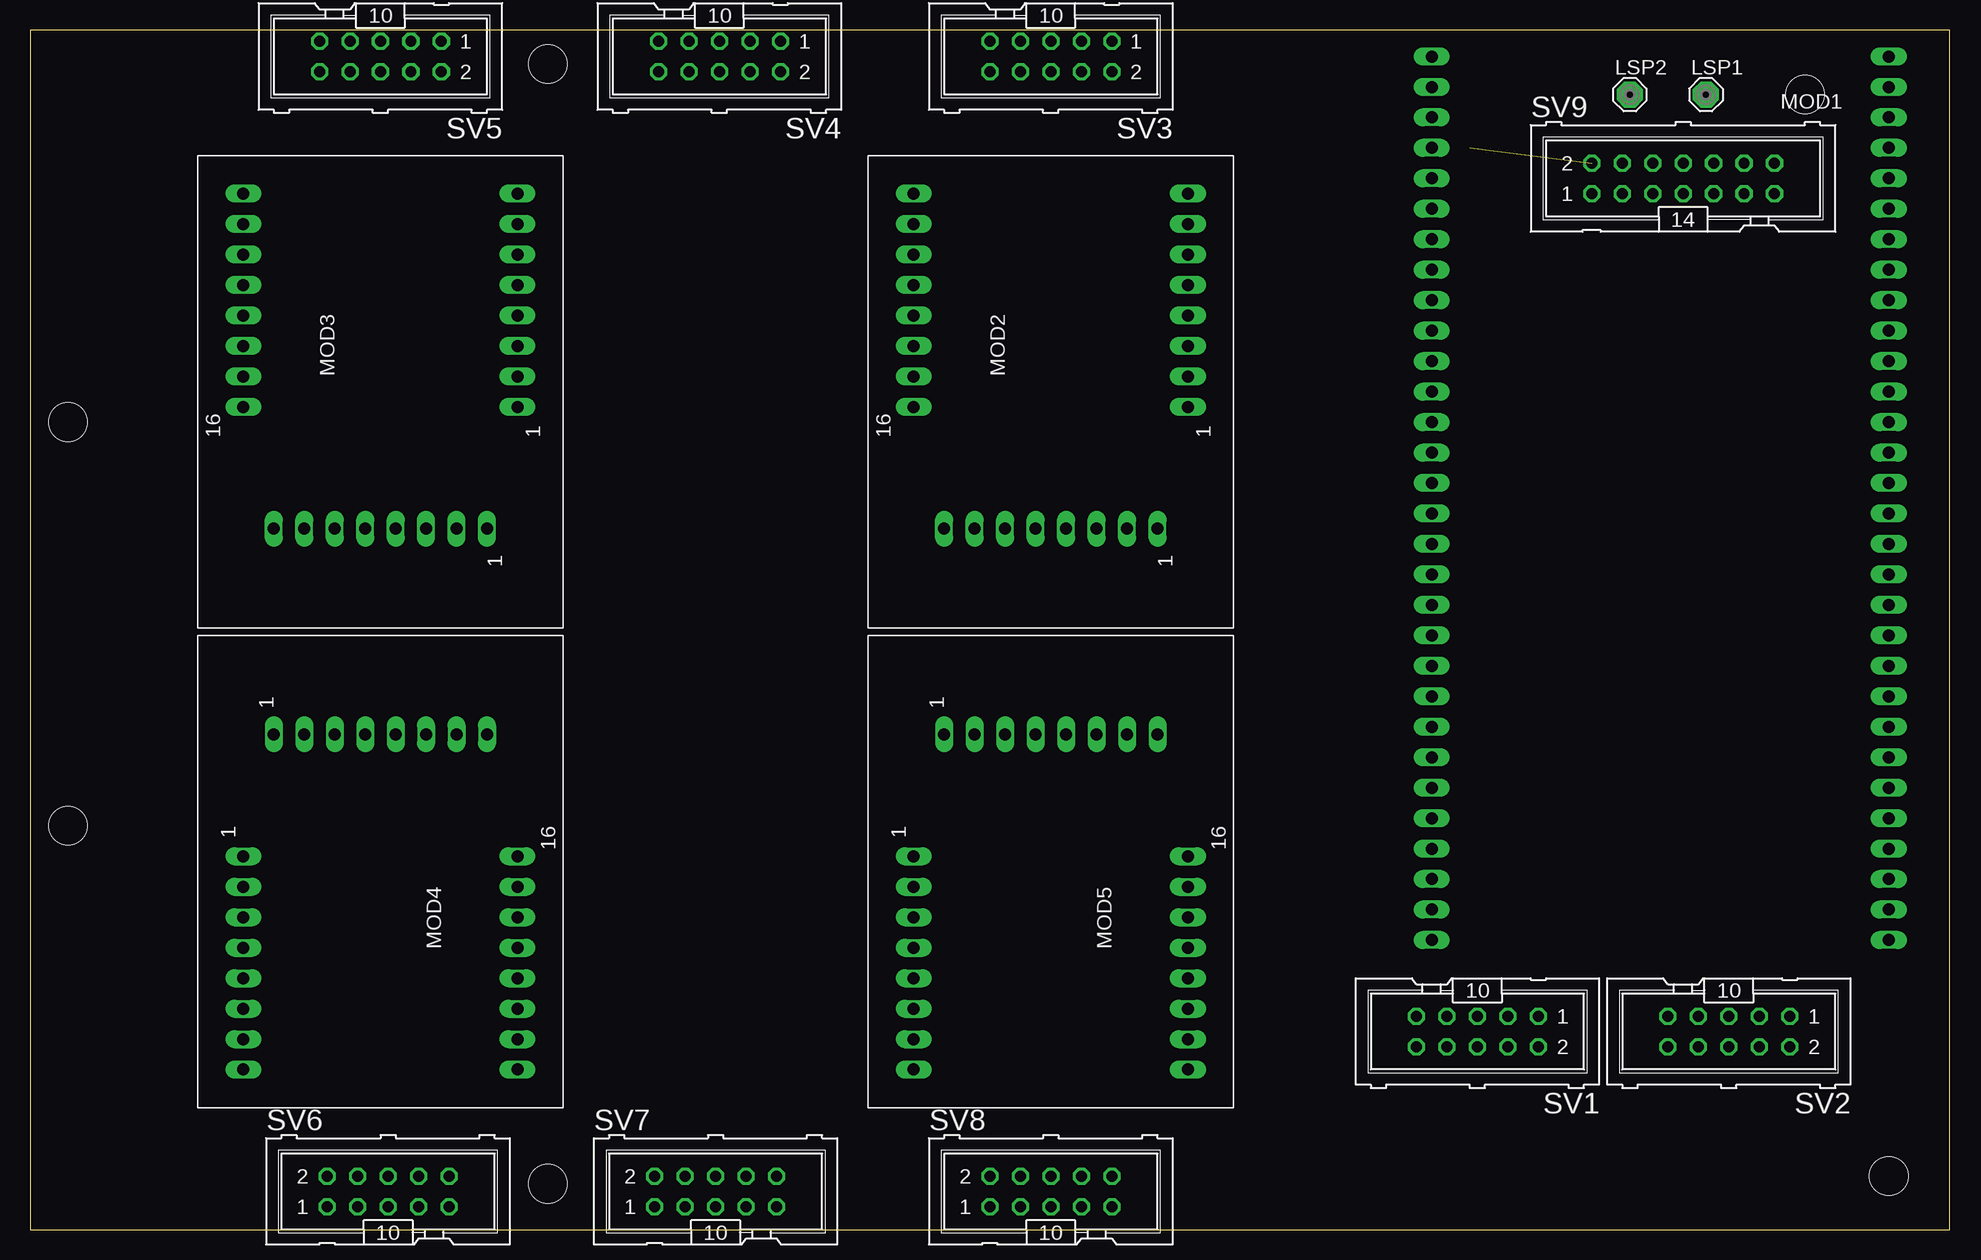
[diagram p6: board, top side]
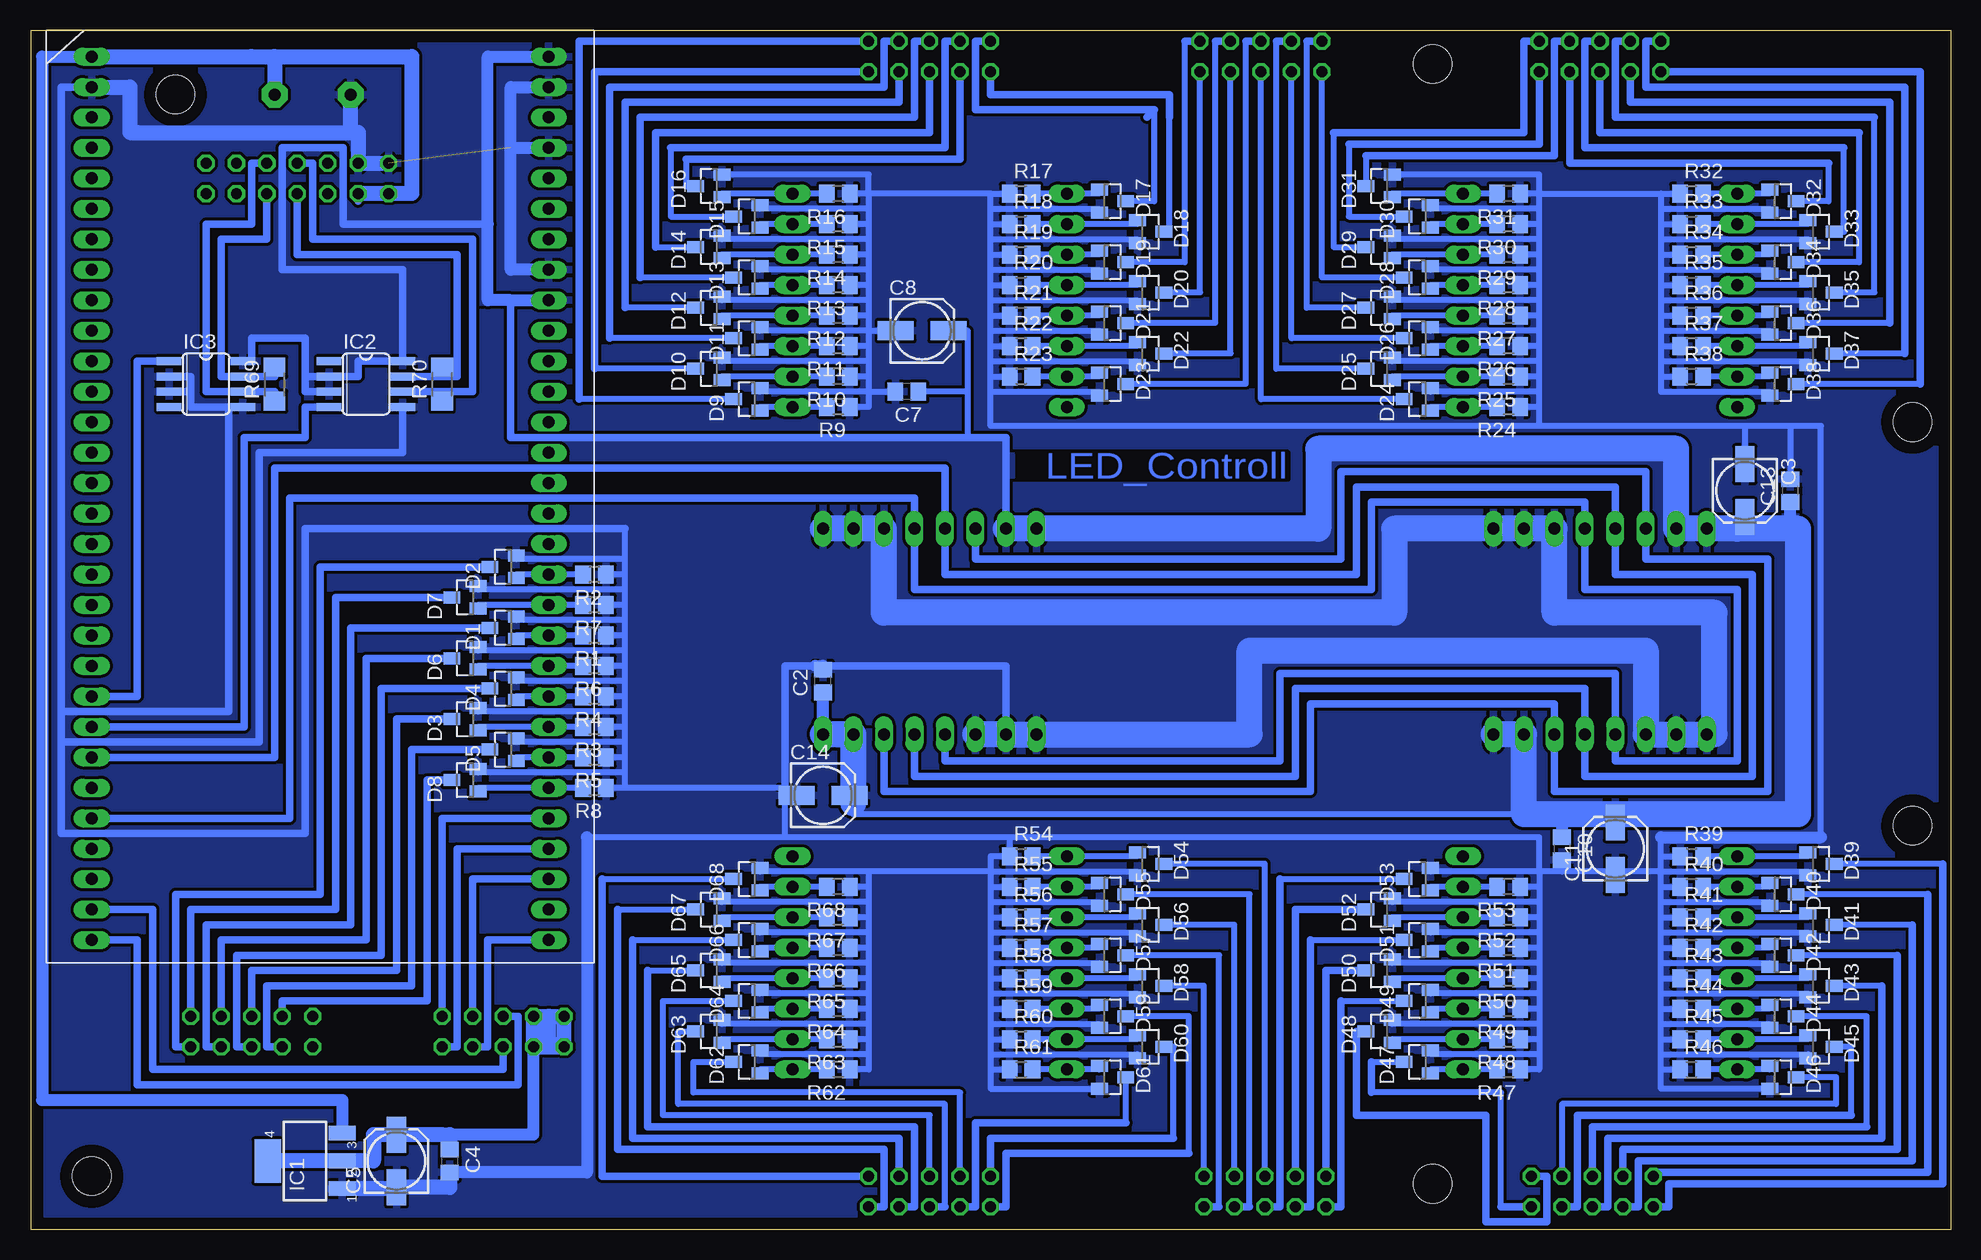
[diagram p7: board, bottom side, seen from below]

Size 160 x 100 mm. Coordinates in mm from the lower left corner, seen from the top.
Outline: 0,0 160,0 160,100 0,100 0,0
Copper layers (1*16): Top 0.035mm / dielectric 1.5mm / Bottom 0.035mm
Design rules "default": minimum track width 10mil, minimum drill 24mil, track to track 8mil, track to pad 8mil, pad to pad 8mil, via to via 8mil, smd to smd 8mil, copper to edge 40mil, drill to drill 8mil, minimum pad ring 10mil, minimum via ring 8mil, stop-mask expansion 4mil, vias tented up to drill 0mil, thermal gap 10mil
Holes 3.2 mm at 43.18,97.16 43.18,3.81 154.94,4.45 147.96,94.61 3.17,33.66 3.17,67.31

### Footprints (pad centres in the part's own frame; a part is rotated, then mirrored left to right if it is on the bottom)
C0805 = smd 1.3 x 1.5: 1 -0.95,0; 2 0.95,0
153CLV-0505 = smd 3 x 1.6: + 2.2,0; - -2.2,0
SOT23 = smd 1 x 1.4: 1 -0.95,-1.1; 2 0.95,-1.1; 3 0,1.1
SOT223 = smd 1.219 x 2.235: 1 -2.311,-3.099; 2 0,-3.099; 3 2.311,-3.099 | smd 3.6 x 2.2: 4 0,3.099
SO08 = smd 0.66 x 2.032: 1 -1.905,-3.073; 2 -0.635,-3.073; 3 0.635,-3.073; 4 1.905,-3.073; 5 1.905,3.073; 6 0.635,3.073; 7 -0.635,3.073; 8 -1.905,3.073
MCS10B = drill 1.016 pad 2.159 octagon: MP 0,0
MOD_MSDP430F16X = drill 1 pad 1.422 long: P$1 41.91,1.905; P$2 41.91,4.445; P$3 41.91,6.985; P$4 41.91,9.525; P$5 41.91,12.065; P$6 41.91,14.605; P$7 41.91,17.145; P$8 41.91,19.685; P$9 41.91,22.225; P$10 41.91,24.765; P$11 41.91,27.305; P$12 41.91,29.845; P$13 41.91,32.385; P$14 41.91,34.925; P$15 41.91,37.465; P$16 41.91,40.005; P$17 41.91,42.545; P$18 41.91,45.085; P$19 41.91,47.625; P$20 41.91,50.165; P$21 41.91,52.705; P$22 41.91,55.245; P$23 41.91,57.785; P$24 41.91,60.325; P$25 41.91,62.865; P$26 41.91,65.405; P$27 41.91,67.945; P$28 41.91,70.485; P$29 41.91,73.025; P$30 41.91,75.565; P$31 3.81,1.905; P$32 3.81,4.445; P$33 3.81,6.985; P$34 3.81,9.525; P$35 3.81,12.065; P$36 3.81,14.605; P$37 3.81,17.145; P$38 3.81,19.685; P$39 3.81,22.225; P$40 3.81,24.765; P$41 3.81,27.305; P$42 3.81,29.845; P$43 3.81,32.385; P$44 3.81,34.925; P$45 3.81,37.465; P$46 3.81,40.005; P$47 3.81,42.545; P$48 3.81,45.085; P$49 3.81,47.625; P$50 3.81,50.165; P$51 3.81,52.705; P$52 3.81,55.245; P$53 3.81,57.785; P$54 3.81,60.325; P$55 3.81,62.865; P$56 3.81,65.405; P$57 3.81,67.945; P$58 3.81,70.485; P$59 3.81,73.025; P$60 3.81,75.565
TLC59116_MOD = drill 1 long: !OUT0 10.16,-2.54; !OUT1 12.7,-2.54; !OUT2 15.24,-2.54; !OUT3 17.78,-2.54; !OUT4 20.32,-2.54; !OUT5 22.86,-2.54; !OUT6 25.4,-2.54; !OUT7 27.94,-2.54; !OUT8 27.94,20.32; !OUT9 25.4,20.32; !OUT10 22.86,20.32; !OUT11+ 20.32,20.32; !OUT12 17.78,20.32; !OUT13 15.24,20.32; !OUT14 12.7,20.32; !OUT15 10.16,20.32; !RESET 0,12.7; GND1 0,5.08; GND2 0,2.54; GND3 0,0; SCL 0,10.16; SDA 0,7.62; VCC1 0,17.78; VCC2 0,15.24
R0805 = smd 1.3 x 1.5: 1 -0.95,0; 2 0.95,0
R1206 = smd 1.6 x 1.803: 1 -1.422,0; 2 1.422,0
ML10 = drill 0.914 octagon: 1 -5.08,-1.27; 2 -5.08,1.27; 3 -2.54,-1.27; 4 -2.54,1.27; 5 0,-1.27; 6 0,1.27; 7 2.54,-1.27; 8 2.54,1.27; 9 5.08,-1.27; 10 5.08,1.27
ML14 = drill 0.914 octagon: 1 -7.62,-1.27; 2 -7.62,1.27; 3 -5.08,-1.27; 4 -5.08,1.27; 5 -2.54,-1.27; 6 -2.54,1.27; 7 0,-1.27; 8 0,1.27; 9 2.54,-1.27; 10 2.54,1.27; 11 5.08,-1.27; 12 5.08,1.27; 13 7.62,-1.27; 14 7.62,1.27

### Placement (x,y rotation side)
C2  93.98,45.72 90 bottom
C3  17.14,61.59 270 bottom
C4  125.09,5.71 270 bottom
C5  129.54,5.71 90 bottom
C7  87,69.85 180 bottom
C8  85.72,74.93 0 bottom
C10  32.38,31.75 270 bottom
C11  27.94,31.75 90 bottom
C13  13.34,61.59 90 bottom
C14  93.98,36.2 0 bottom
D1  120.65,50.16 90 bottom
D2  120.65,55.24 90 bottom
D3  123.83,42.55 90 bottom
D4  120.65,45.09 90 bottom
D5  120.65,40.01 90 bottom
D6  123.83,47.62 90 bottom
D7  123.83,52.7 90 bottom
D8  123.83,37.47 90 bottom
D9  100.33,69.22 90 bottom
D10  103.5,71.75 90 bottom
D11  100.33,74.3 90 bottom
D12  103.5,76.83 90 bottom
D13  100.33,79.38 90 bottom
D14  103.5,81.92 90 bottom
D15  100.33,84.45 90 bottom
D16  103.5,87 90 bottom
D17  69.85,85.72 270 bottom
D18  66.67,83.19 270 bottom
D19  69.85,80.64 270 bottom
D20  66.67,78.11 270 bottom
D21  69.85,75.56 270 bottom
D22  66.67,73.03 270 bottom
D23  69.85,70.48 270 bottom
D24  44.45,69.22 90 bottom
D25  47.62,71.75 90 bottom
D26  44.45,74.3 90 bottom
D27  47.62,76.83 90 bottom
D28  44.45,79.38 90 bottom
D29  47.62,81.92 90 bottom
D30  44.45,84.45 90 bottom
D31  47.62,87 90 bottom
D32  13.97,85.72 270 bottom
D33  10.79,83.19 270 bottom
D34  13.97,80.64 270 bottom
D35  10.79,78.11 270 bottom
D36  13.97,75.56 270 bottom
D37  10.79,73.03 270 bottom
D38  13.97,70.48 270 bottom
D39  10.79,30.48 270 bottom
D40  13.97,27.94 270 bottom
D41  10.79,25.4 270 bottom
D42  13.97,22.86 270 bottom
D43  10.79,20.32 270 bottom
D44  13.97,17.78 270 bottom
D45  10.79,15.24 270 bottom
D46  13.97,12.7 270 bottom
D47  44.45,13.97 90 bottom
D48  47.62,16.51 90 bottom
D49  44.45,19.05 90 bottom
D50  47.62,21.59 90 bottom
D51  44.45,24.13 90 bottom
D52  47.62,26.67 90 bottom
D53  44.45,29.21 90 bottom
D54  66.67,30.48 270 bottom
D55  69.85,27.94 270 bottom
D56  66.67,25.4 270 bottom
D57  69.85,22.86 270 bottom
D58  66.67,20.32 270 bottom
D59  69.85,17.78 270 bottom
D60  66.67,15.24 270 bottom
D61  69.85,12.7 270 bottom
D62  100.33,13.97 90 bottom
D63  103.5,16.51 90 bottom
D64  100.33,19.05 90 bottom
D65  103.5,21.59 90 bottom
D66  100.33,24.13 90 bottom
D67  103.5,26.67 90 bottom
D68  100.33,29.21 90 bottom
IC1  137.16,5.71 90 bottom
IC2  132.08,70.48 270 bottom
IC3  145.41,70.48 270 bottom
LSP1  139.7,94.61 0 top
LSP2  133.35,94.61 0 top
MOD1  113.03,22.23 0 top
MOD2  93.98,58.42 90 top
MOD3  38.1,58.42 90 top
MOD4  20.32,41.27 270 top
MOD5  76.2,41.27 270 top
R1  113.03,49.53 180 bottom
R2  113.03,54.61 180 bottom
R3  113.03,41.91 180 bottom
R4  113.03,44.45 180 bottom
R5  113.03,39.37 180 bottom
R6  113.03,46.99 180 bottom
R7  113.03,52.07 180 bottom
R8  113.03,36.83 180 bottom
R9  92.71,68.58 180 bottom
R10  92.71,71.12 180 bottom
R11  92.71,73.66 180 bottom
R12  92.71,76.2 180 bottom
R13  92.71,78.74 180 bottom
R14  92.71,81.28 180 bottom
R15  92.71,83.82 180 bottom
R16  92.71,86.36 180 bottom
R17  77.47,86.36 0 bottom
R18  77.47,83.82 0 bottom
R19  77.47,81.28 0 bottom
R20  77.47,78.74 0 bottom
R21  77.47,76.2 0 bottom
R22  77.47,73.66 0 bottom
R23  77.47,71.12 0 bottom
R24  36.83,68.58 180 bottom
R25  36.83,71.12 180 bottom
R26  36.83,73.66 180 bottom
R27  36.83,76.2 180 bottom
R28  36.83,78.74 180 bottom
R29  36.83,81.28 180 bottom
R30  36.83,83.82 180 bottom
R31  36.83,86.36 180 bottom
R32  21.59,86.36 0 bottom
R33  21.59,83.82 0 bottom
R34  21.59,81.28 0 bottom
R35  21.59,78.74 0 bottom
R36  21.59,76.2 0 bottom
R37  21.59,73.66 0 bottom
R38  21.59,71.12 0 bottom
R39  21.59,31.11 0 bottom
R40  21.59,28.57 0 bottom
R41  21.59,26.04 0 bottom
R42  21.59,23.5 0 bottom
R43  21.59,20.95 0 bottom
R44  21.59,18.41 0 bottom
R45  21.59,15.88 0 bottom
R46  21.59,13.34 0 bottom
R47  36.83,13.34 180 bottom
R48  36.83,15.88 180 bottom
R49  36.83,18.41 180 bottom
R50  36.83,20.95 180 bottom
R51  36.83,23.5 180 bottom
R52  36.83,26.04 180 bottom
R53  36.83,28.57 180 bottom
R54  77.47,31.11 0 bottom
R55  77.47,28.57 0 bottom
R56  77.47,26.04 0 bottom
R57  77.47,23.5 0 bottom
R58  77.47,20.95 0 bottom
R59  77.47,18.41 0 bottom
R60  77.47,15.88 0 bottom
R61  77.47,13.34 0 bottom
R62  92.71,13.34 180 bottom
R63  92.71,15.88 180 bottom
R64  92.71,18.41 180 bottom
R65  92.71,20.95 180 bottom
R66  92.71,23.5 180 bottom
R67  92.71,26.04 180 bottom
R68  92.71,28.57 180 bottom
R69  139.7,70.48 90 bottom
R70  125.73,70.48 90 bottom
SV1  120.65,16.51 180 top
SV2  141.6,16.51 180 top
SV3  85.09,97.79 180 top
SV4  57.47,97.79 180 top
SV5  29.21,97.79 180 top
SV6  29.84,3.17 0 top
SV7  57.15,3.17 0 top
SV8  85.09,3.17 0 top
SV9  137.79,87.63 0 top

### Tracks (layer width: path | path; a pad name or v marks a point on that pad's centre or on a via)
7
  Bottom 0.61: R70.2 125.73,71.12 IC2.7 124.46,71.12 124.46,81.28 137.79,81.28 SV9.7
8
  Bottom 0.61: R70.1 125.73,69.85 IC2.6 123.19,69.85 123.19,82.55 136.53,82.55 136.53,88.9 SV9.8
9
  Bottom 0.61: R69.2 139.7,71.12 IC3.7 144.15,71.12 144.15,82.55 140.34,82.55 SV9.9
10
  Bottom 0.61: R69.1 139.7,69.85 IC3.6 145.41,69.85 145.41,83.82 141.6,83.82 141.6,88.9 SV9.10
!RST_TLC
  Bottom 0.61: MOD5.!RESET 88.9,36.51 53.34,36.51 53.34,43.81 33.02,43.81 MOD4.!RESET 33.02,36.51 15.24,36.51 15.24,55.88 25.4,55.88 MOD3.!RESET 25.4,63.18 50.8,63.18 50.8,55.88 81.28,55.88 MOD2.!RESET
+3V3
  Bottom 0.5: 91.44,35.56 91.44,34.61 35.56,34.61 | C8.+ 81.92,74.93 81.92,69.85 | 81.92,69.85 C7.1 | 81.92,66.04 81.92,69.85
  Bottom 0.61: 120.02,77.47 120.02,66.04 81.92,66.04 78.74,66.04 MOD2.VCC2 | IC2.3 137.16,69.85 137.16,71.12 | IC3.8 141.6,72.39 141.6,74.3 137.16,74.3 137.16,71.12 | 137.16,71.12 IC2.2 132.72,71.12 132.72,72.39 IC2.8 129.01,80.01 139.06,80.01 139.06,90.17 133.99,90.17 133.99,83.82 121.92,83.82
  Bottom 1.016: C3.+ 17.14,58.42 17.78,58.42 | 13.34,58.42 C13.1 | C11.+ 27.94,34.61 28.57,34.61 | C10.1 32.38,34.61 33.02,34.61 | MOD5.VCC1 C2.1 | C14.+ 91.78,35.56 91.44,35.56 | MOD1.P$52 120.02,77.47 121.92,77.47 121.92,83.82 121.92,97.79 MOD1.P$60
  Bottom 2.184: MOD4.VCC1 MOD4.VCC2 35.56,34.61 33.02,34.61 28.57,34.61 12.7,34.61 12.7,58.42 13.34,58.42 17.78,58.42 MOD3.VCC1 MOD3.VCC2 22.86,65.09 52.7,65.09 52.7,58.42 MOD2.VCC1 MOD2.VCC2 | MOD5.VCC1 MOD5.VCC2 91.44,35.56
  pour Bottom (rank 2): 0,0 0,99.69 160.02,99.69 160.02,0
+5V
  Bottom 0.61: SV9.3 132.72,85.72
  Bottom 1.016: MOD1.P$30 159.07,97.79 159.07,10.79 134.06,10.79 IC1.3
  Bottom 1.27: MOD1.P$30 141.6,97.79 139.7,97.79 | 139.7,97.79 128.27,97.79 128.27,86.36 SV9.1 SV9.3 | 139.7,97.79 LSP1.MP
+UB
  Bottom 0.61: SV1.8 117.47,15.24
  Bottom 1.016: SV1.8 118.11,7.92 125.73,7.92
  Bottom 1.27: IC1.4 IC1.2 131.44,5.71 131.44,7.92 C5.+ 125.73,7.92 125.09,7.92 C4.1 | SV1.7 SV1.9 SV1.10 SV1.8 | SV1.8 SV1.7 | SV1.7 116.84,17.78 116.84,15.88 118.11,15.88 SV1.8
DGND  (1 unrouted)
  Bottom 0.5: D2.2 119.55,55.88 110.49,55.88 | 110.49,54.61 110.49,55.88 | 110.49,53.34 110.49,54.61 | 110.49,52.07 110.49,53.34 | 110.49,50.8 110.49,52.07 | 110.49,49.53 110.49,50.8 | 110.49,48.26 110.49,49.53 | 110.49,46.99 110.49,48.26 | 110.49,45.72 110.49,46.99 | 110.49,44.45 110.49,45.72 | 110.49,43.18 110.49,44.45 | 110.49,41.91 110.49,43.18 | 110.49,40.64 110.49,41.91 | 110.49,39.37 110.49,40.64 | 110.49,38.1 110.49,39.37 | 110.49,36.83 110.49,38.1 | 110.49,54.61 R2.1 | 110.49,52.07 R7.1 | 110.49,49.53 R1.1 | 110.49,46.99 R6.1 | 110.49,44.45 R4.1 | 110.49,41.91 R3.1 | 110.49,39.37 R5.1 | D7.2 122.72,53.34 110.49,53.34 | D1.2 119.55,50.8 110.49,50.8 | D6.2 122.72,48.26 110.49,48.26 | D4.2 119.55,45.72 110.49,45.72 | D3.2 122.72,43.18 110.49,43.18 | D5.2 119.55,40.64 110.49,40.64 | D8.2 122.72,38.1 110.49,38.1 | 110.49,36.83 R8.1 | D32.2 15.07,85.09 24.13,85.09 | 24.13,86.36 24.13,85.09 | 24.13,86.36 R32.1 | 24.13,71.12 R38.1 | 24.13,77.47 24.13,76.2 | 24.13,76.2 24.13,74.93 | 24.13,73.66 24.13,72.39 | 24.13,74.93 24.13,73.66 | 24.13,72.39 24.13,71.12 | 24.13,78.74 24.13,77.47 | 24.13,80.01 24.13,78.74 | 24.13,81.28 24.13,80.01 | 24.13,82.55 24.13,81.28 | 24.13,83.82 24.13,82.55 | 24.13,85.09 24.13,83.82 | 24.13,83.82 R33.1 | D33.2 11.89,82.55 24.13,82.55 | D34.2 15.07,80.01 24.13,80.01 | D35.2 11.89,77.47 24.13,77.47 | 24.13,76.2 R36.1 | 24.13,78.74 R35.1 | 24.13,81.28 R34.1 | D36.2 15.07,74.93 24.13,74.93 | D37.2 11.89,72.39 24.13,72.39 | 24.13,73.66 R37.1 | D38.2 15.07,69.85 24.13,69.85 24.13,71.12 | D31.2 34.29,87.94 34.29,86.36 | 34.29,68.58 34.29,69.85 | 34.29,69.85 34.29,71.12 | 34.29,71.12 34.29,72.39 | 34.29,72.39 34.29,73.66 | 34.29,73.66 34.29,74.93 | 34.29,74.93 34.29,76.2
  Bottom 0.5: 34.29,76.2 34.29,77.47 | 34.29,77.47 34.29,78.74 | 34.29,78.74 34.29,80.01 | 34.29,80.01 34.29,81.28 | 34.29,81.28 34.29,82.55 | 34.29,82.55 34.29,83.82 | 34.29,83.82 34.29,85.09 | 34.29,85.09 34.29,86.36 | 34.29,71.12 R25.1 | 34.29,73.66 R26.1 | 34.29,76.2 R27.1 | 34.29,78.74 R28.1 | 34.29,81.28 R29.1 | 34.29,83.82 R30.1 | 34.29,86.36 R31.1 | D29.2 46.52,82.55 34.29,82.55 | D24.2 43.35,69.85 34.29,69.85 | D25.2 46.52,72.39 34.29,72.39 | D26.2 43.35,74.93 34.29,74.93 | D27.2 46.52,77.47 34.29,77.47 | D28.2 43.35,80.01 34.29,80.01 | D30.2 43.35,85.09 34.29,85.09 | 34.29,86.36 24.13,86.36 | D18.2 67.78,82.55 80.01,82.55 | 80.01,82.55 80.01,83.82 | 80.01,85.09 80.01,86.36 | 80.01,86.36 R17.1 | 80.01,71.12 R23.1 | 80.01,72.39 80.01,73.66 | 80.01,71.12 80.01,72.39 | 80.01,74.93 80.01,76.2 | 80.01,73.66 80.01,74.93 | 80.01,76.2 80.01,77.47 | 80.01,77.47 80.01,78.74 | 80.01,78.74 80.01,80.01 | 80.01,80.01 80.01,81.28 | 80.01,81.28 80.01,82.55 | 80.01,73.66 R22.1 | 80.01,76.2 R21.1 | 80.01,78.74 R20.1 | 80.01,81.28 R19.1 | 80.01,83.82 R18.1 | 80.01,83.82 80.01,85.09 | D17.2 70.95,85.09 80.01,85.09 | D19.2 70.95,80.01 80.01,80.01 | D20.2 67.78,77.47 80.01,77.47 | D21.2 70.95,74.93 80.01,74.93 | D22.2 67.78,72.39 80.01,72.39 | D23.2 70.95,69.85 80.01,69.85 | 80.01,69.85 80.01,71.12 | D16.2 90.17,87.94 90.17,86.36 | 90.17,71.12 90.17,69.85 | 90.17,72.39 90.17,71.12 | 90.17,73.66 90.17,72.39 | 90.17,74.93 90.17,73.66 | 90.17,76.2 90.17,74.93 | 90.17,77.47 90.17,76.2 | 90.17,78.74 90.17,77.47 | 90.17,80.01 90.17,78.74 | 90.17,81.28 90.17,80.01 | 90.17,82.55 90.17,81.28 | 90.17,83.82 90.17,82.55 | 90.17,85.09 90.17,83.82 | 90.17,86.36 90.17,85.09 | R9.1 90.17,68.58 90.17,69.85 | 90.17,71.12 R10.1
  Bottom 0.5: 90.17,73.66 R11.1 | 90.17,76.2 R12.1 | 90.17,78.74 R13.1 | 90.17,81.28 R14.1 | 90.17,83.82 R15.1 | 90.17,86.36 R16.1 | D15.2 99.23,85.09 90.17,85.09 | D14.2 102.41,82.55 90.17,82.55 | D13.2 99.23,80.01 90.17,80.01 | D12.2 102.41,77.47 90.17,77.47 | D10.2 102.41,72.39 90.17,72.39 | D11.2 99.23,74.93 90.17,74.93 | D9.2 99.23,69.85 90.17,69.85 | 80.01,86.36 90.17,86.36 | D45.2 11.89,14.61 24.13,14.61 | 24.13,14.61 24.13,15.88 | 24.13,15.88 24.13,17.14 | 24.13,17.14 24.13,18.41 | 24.13,18.41 24.13,19.68 | 24.13,19.68 24.13,20.95 | 24.13,20.95 24.13,22.23 | 24.13,22.23 24.13,23.5 | 24.13,23.5 24.13,24.77 | 24.13,24.77 24.13,26.04 | 24.13,26.04 24.13,27.3 | 24.13,28.57 24.13,29.84 | 24.13,31.11 R39.1 | D46.2 24.13,11.75 24.13,13.34 | 24.13,13.34 24.13,14.61 | 24.13,13.34 R46.1 | 24.13,15.88 R45.1 | 24.13,18.41 R44.1 | 24.13,20.95 R43.1 | 24.13,23.5 R42.1 | 24.13,26.04 R41.1 | 24.13,28.57 R40.1 | 24.13,27.3 24.13,28.57 | D40.2 15.07,27.3 24.13,27.3 | D41.2 11.89,24.77 24.13,24.77 | D42.2 15.07,22.23 24.13,22.23 | D43.2 11.89,19.68 24.13,19.68 | D44.2 15.07,17.14 24.13,17.14 | R47.1 34.29,13.34 34.29,14.61 | 34.29,15.88 34.29,14.61 | 34.29,17.14 34.29,15.88 | 34.29,18.41 34.29,17.14 | 34.29,22.23 34.29,20.95 | 34.29,23.5 34.29,22.23 | 34.29,24.77 34.29,23.5 | 34.29,26.04 34.29,24.77 | 34.29,27.3 34.29,26.04 | 34.29,28.57 34.29,27.3 | 34.29,29.84 43.35,29.84 D53.2 | 34.29,28.57 R53.1 | 34.29,26.04 R52.1 | 34.29,23.5 R51.1 | 34.29,20.95 R50.1 | 34.29,19.68 34.29,18.41 | 34.29,20.95 34.29,19.68 | 34.29,18.41 R49.1 | 34.29,15.88 R48.1 | D47.2 43.35,14.61 34.29,14.61 | D48.2 46.52,17.14 34.29,17.14 | D49.2 43.35,19.68 34.29,19.68 | D50.2 46.52,22.23 34.29,22.23 | D51.2 43.35,24.77 34.29,24.77
  Bottom 0.5: D52.2 46.52,27.3 34.29,27.3 | 34.29,29.84 34.29,28.57 | 24.13,29.84 27.94,29.84 | 27.94,29.84 32.38,29.84 | 32.38,29.84 34.29,29.84 | 80.01,15.88 80.01,14.61 | 80.01,14.61 80.01,13.34 | 80.01,18.41 80.01,17.14 | 80.01,17.14 80.01,15.88 | 80.01,19.68 80.01,18.41 | 80.01,20.95 80.01,19.68 | 80.01,22.23 80.01,20.95 | 80.01,23.5 80.01,22.23 | 80.01,24.77 80.01,23.5 | 80.01,26.04 80.01,24.77 | 80.01,27.3 80.01,26.04 | 80.01,28.57 80.01,27.3 | 80.01,29.84 80.01,28.57 | 80.01,29.84 80.01,31.11 R54.1 78.42,32.7 | 80.01,13.34 R61.1 | 80.01,15.88 R60.1 | 80.01,18.41 R59.1 | 80.01,20.95 R58.1 | 80.01,23.5 R57.1 | 80.01,26.04 R56.1 | 80.01,28.57 R55.1 | D54.2 67.78,29.84 80.01,29.84 | D55.2 70.95,27.3 80.01,27.3 | D56.2 67.78,24.77 80.01,24.77 | D57.2 70.95,22.23 80.01,22.23 | D58.2 67.78,19.68 80.01,19.68 | D59.2 70.95,17.14 80.01,17.14 | D60.2 67.78,14.61 80.01,14.61 | D61.2 80.01,11.75 80.01,13.34 | 90.17,28.57 R68.1 | 90.17,15.88 90.17,14.61 | 90.17,14.61 90.17,13.34 R62.1 | 90.17,18.41 90.17,17.14 | 90.17,17.14 90.17,15.88 | 90.17,20.95 90.17,19.68 | 90.17,19.68 90.17,18.41 | 90.17,23.5 90.17,22.23 | 90.17,22.23 90.17,20.95 | 90.17,26.04 90.17,24.77 | 90.17,24.77 90.17,23.5 | 90.17,28.57 90.17,27.3 | 90.17,27.3 90.17,26.04 | 90.17,15.88 R63.1 | 90.17,18.41 R64.1 | 90.17,20.95 R65.1 | 90.17,23.5 R66.1 | D68.2 99.23,29.84 90.17,29.84 | 80.01,29.84 90.17,29.84 | 90.17,26.04 R67.1 | 90.17,29.84 90.17,28.57 | D62.2 99.23,14.61 90.17,14.61 | D63.2 102.41,17.14 90.17,17.14 | D64.2 99.23,19.68 90.17,19.68 | D65.2 102.41,22.23 90.17,22.23 | D66.2 99.23,24.77 90.17,24.77 | D67.2 102.41,27.3 90.17,27.3 | 34.29,68.58 R24.1 | 34.29,66.99 34.29,68.58 | 34.29,66.99 80.01,66.99 80.01,69.85
  Bottom 0.5: 13.34,66.99 10.79,66.99 10.79,32.7 | 24.13,31.11 24.13,32.7 | 78.42,32.7 34.29,32.7 34.29,29.84 | 97.16,32.7 97.16,36.2 | 78.42,32.7 97.16,32.7 | 110.49,55.88 110.49,58.42 | 97.16,36.83 110.49,36.83 | 97.16,32.7 113.67,32.7 | 90.17,69.85 C7.2 | 90.17,74.93 C8.- | 13.34,66.99 C13.2 | 13.34,66.99 17.14,66.99 | 17.14,66.99 C3.- | 17.14,66.99 34.29,66.99 | 27.94,29.84 C11.- | 32.38,29.84 C10.2 | 24.13,29.84 24.13,31.11 | D39.2 11.89,29.84 24.13,29.84
  Bottom 0.61: MOD5.GND2 78.74,46.99 94.61,46.99 97.16,46.99 97.16,36.83 97.16,36.2 | MOD1.P$29 157.48,95.25 157.48,43.18 | 157.48,40.64 157.48,33.02 137.16,33.02 137.16,58.42 110.49,58.42 | 157.48,40.64 157.48,43.18 | 151.13,91.44 147.96,91.44 | IC2.5 129.01,64.77 140.97,64.77 140.97,40.64 157.48,40.64 | 143.51,68.58 IC3.5 | 143.51,68.58 143.51,43.18 157.48,43.18 | IC3.2 146.69,71.12 146.69,69.85 | 146.69,69.85 146.69,68.58 143.51,68.58 | 146.69,69.85 IC3.3
  Bottom 1.016: C4.2 113.67,4.76 113.67,32.7 | C2.2 93.98,46.99 94.61,46.99 | 97.16,36.2 C14.- | 120.02,90.17 MOD1.P$57 | MOD1.P$59 120.02,95.25 120.02,90.17 | 120.02,90.17 120.02,80.01 MOD1.P$53 | 24.13,32.7 10.79,32.7 | MOD4.GND3 19.68,41.27
  Bottom 1.27: C4.2 125.09,3.52 C5.- 129.54,3.4 IC1.1 | MOD1.P$29 151.76,95.25 151.76,91.44 151.13,91.44 133.35,91.44 | 133.35,91.44 132.72,91.44 SV9.4 SV9.2 | 133.35,91.44 LSP2.MP
  Bottom 2.184: MOD5.GND2 MOD5.GND1 | MOD5.GND2 MOD5.GND3 | 19.68,41.27 19.68,51.44 33.02,51.44 MOD3.GND1 MOD3.GND2 MOD3.GND3 46.35,58.42 46.35,51.44 88.9,51.44 MOD2.GND1 MOD2.GND2 MOD2.GND3 | MOD5.GND2 58.42,41.27 58.42,48.26 25.4,48.26 MOD4.GND1 MOD4.GND2 MOD4.GND3
  pour Bottom: 0,99.69 0,0 160.02,0 160.02,99.69
DIS0
  Bottom 0.61: MOD1.P$35 125.73,34.29 SV1.1
DIS1
  Bottom 0.61: MOD1.P$34 124.46,31.75 124.46,15.24 SV1.2
DIS2
  Bottom 0.61: MOD1.P$33 123.19,29.21 SV1.3
DIS3
  Bottom 0.61: MOD1.P$31 121.92,24.13 121.92,15.24 SV1.4
DIS4
  Bottom 0.61: SV1.5 119.38,17.78 119.38,12.06 151.13,12.06 151.13,24.13 MOD1.P$1
DIS5
  Bottom 0.61: SV1.6 120.65,13.34 149.86,13.34 149.86,26.67 MOD1.P$2
LED1
  Bottom 0.5: D9.3 114.3,69.22
  Bottom 0.61: SV3.1 114.3,99.06 114.3,69.22
LED2
  Bottom 0.5: D10.3 113.03,71.75
  Bottom 0.61: SV3.2 113.03,96.52 113.03,71.75
LED3
  Bottom 0.5: D11.3 111.76,74.3
  Bottom 0.61: SV3.3 88.9,99.06 88.9,95.25 111.76,95.25 111.76,74.3
LED4
  Bottom 0.5: D12.3 110.49,76.83
  Bottom 0.61: SV3.4 87.63,93.98 110.49,93.98 110.49,76.83
LED5
  Bottom 0.5: D13.3 109.22,79.38
  Bottom 0.61: SV3.5 86.36,99.06 86.36,92.71 109.22,92.71 109.22,79.38
LED6
  Bottom 0.5: 107.95,81.92 D14.3
  Bottom 0.61: SV3.6 85.09,91.44 107.95,91.44 107.95,81.92
LED7
  Bottom 0.5: 106.68,90.17 106.68,84.45 D15.3
  Bottom 0.61: SV3.7 83.82,99.06 83.82,90.17 106.68,90.17
LED8
  Bottom 0.5: 105.41,89.22 105.41,87 D16.3
  Bottom 0.61: SV3.8 82.55,89.22 105.41,89.22
LED9
  Bottom 0.5: D17.3 66.36,85.72 66.36,93.34
  Bottom 0.61: 66.99,92.71 66.36,93.34 81.28,93.34 81.28,99.06 SV3.9
LED10
  Bottom 0.5: D18.3 65.09,83.19 65.09,92.71
  Bottom 0.61: 65.09,92.71 65.09,93.34 65.09,94.61 80.01,94.61 SV3.10
LED11
  Bottom 0.5: 63.82,99.06 63.82,80.64 D19.3
  Bottom 0.61: 63.82,99.06 SV4.1
LED12
  Bottom 0.5: SV4.2 62.55,78.11 D20.3
LED13
  Bottom 0.5: 61.28,99.06 61.28,75.56 D21.3
  Bottom 0.61: 61.28,99.06 SV4.3
LED14
  Bottom 0.5: SV4.4 60.01,73.03 D22.3
LED15
  Bottom 0.5: 58.74,99.06 58.74,70.48 D23.3
  Bottom 0.61: 58.74,99.06 SV4.5
LED16
  Bottom 0.5: D24.3 57.47,69.22 SV4.6
LED17
  Bottom 0.5: D25.3 56.2,71.75 56.2,99.06
  Bottom 0.61: 56.2,99.06 SV4.7
LED18
  Bottom 0.5: D26.3 54.93,74.3 SV4.8
LED19
  Bottom 0.5: D27.3 53.66,76.83 53.66,99.06
  Bottom 0.61: 53.66,99.06 SV4.9
LED20
  Bottom 0.5: D28.3 52.39,79.38 SV4.10
LED21
  Bottom 0.5: D29.3 51.44,81.92 51.44,91.44
  Bottom 0.61: 51.44,91.44 35.56,91.44 35.56,99.06 SV5.1
LED22
  Bottom 0.5: D30.3 50.16,84.45 50.16,90.49
  Bottom 0.61: 50.16,90.49 34.29,90.49 SV5.2
LED23
  Bottom 0.5: 48.73,89.53 D31.3
  Bottom 0.61: 48.73,89.53 33.02,89.53 33.02,99.06 SV5.3
LED24
  Bottom 0.5: 10.16,88.9 10.16,85.72 D32.3
  Bottom 0.61: SV5.4 31.75,88.9 10.16,88.9
LED25
  Bottom 0.5: 8.89,90.17 8.89,83.19 D33.3
  Bottom 0.61: SV5.5 30.48,99.06 30.48,90.17 8.89,90.17
LED26
  Bottom 0.5: 7.62,91.44 7.62,80.64 D34.3
  Bottom 0.61: SV5.6 29.21,91.44 7.62,91.44
LED27
  Bottom 0.5: 6.35,92.71 6.35,78.11 D35.3
  Bottom 0.61: SV5.7 27.94,99.06 27.94,92.71 6.35,92.71
LED28
  Bottom 0.5: 5.08,75.56 D36.3
  Bottom 0.61: SV5.8 26.67,93.98 5.08,93.98 5.08,75.56
LED29
  Bottom 0.5: 3.81,73.03 D37.3
  Bottom 0.61: SV5.9 25.4,99.06 25.4,95.25 3.81,95.25 3.81,73.03
LED30
  Bottom 0.5: 2.54,70.48 D38.3
  Bottom 0.61: SV5.10 2.54,96.52 2.54,70.48
LED31
  Bottom 0.5: 0.64,30.48 D39.3
  Bottom 0.61: 0.64,30.48 0.64,3.81 23.5,3.81 23.5,1.91 SV6.1
LED32
  Bottom 0.5: 1.91,27.94 D40.3
  Bottom 0.61: 1.91,27.94 1.91,4.76 24.77,4.76 SV6.2
LED33
  Bottom 0.5: 3.17,25.4 D41.3
  Bottom 0.61: 3.17,25.4 3.17,5.71 26.04,5.71 26.04,1.91 SV6.3
LED34
  Bottom 0.5: 4.45,22.86 D42.3
  Bottom 0.61: 4.45,22.86 4.45,6.67 27.3,6.67 SV6.4
LED35
  Bottom 0.5: 5.71,20.32 D43.3
  Bottom 0.61: 5.71,20.32 5.71,7.62 28.57,7.62 28.57,1.91 SV6.5
LED36
  Bottom 0.5: D44.3 6.99,17.78 6.99,8.57
  Bottom 0.61: 6.99,8.57 29.84,8.57 SV6.6
LED37
  Bottom 0.5: D45.3 8.26,15.24 8.26,9.53
  Bottom 0.61: 8.26,9.53 31.11,9.53 31.11,1.91 SV6.7
LED38
  Bottom 0.5: D46.3 9.53,12.7 9.53,10.48 32.38,10.48 SV6.8
LED39
  Bottom 0.5: 48.26,13.97 D47.3 | 48.26,11.43 37.47,11.43 37.47,1.91
  Bottom 0.61: 48.26,11.43 48.26,13.97 | SV6.9 37.47,1.91
LED40
  Bottom 0.61: D48.3 49.53,16.51 49.53,9.53 38.73,9.53 38.73,0.64 33.66,0.64 33.66,4.45 SV6.10
LED41
  Bottom 0.5: 50.8,19.05 D49.3
  Bottom 0.61: SV7.1 50.8,1.91 50.8,19.05
LED42
  Bottom 0.61: SV7.2 52.07,21.59 D50.3
LED43
  Bottom 0.5: 53.34,24.13 D51.3
  Bottom 0.61: SV7.3 53.34,1.91 53.34,24.13
LED44
  Bottom 0.61: SV7.4 54.61,26.67 D52.3
LED45
  Bottom 0.5: 55.88,29.21 D53.3
  Bottom 0.61: SV7.5 55.88,1.91 55.88,29.21
LED46
  Bottom 0.5: SV7.6 57.15,30.48 D54.3
LED47
  Bottom 0.5: 58.42,1.91 58.42,27.94 D55.3
  Bottom 0.61: SV7.7 58.42,1.91
LED48
  Bottom 0.5: SV7.8 59.69,25.4 D56.3
LED49
  Bottom 0.5: 60.96,1.91 60.96,22.86 D57.3
  Bottom 0.61: SV7.9 60.96,1.91
LED50
  Bottom 0.5: SV7.10 62.23,20.32 D58.3
LED51
  Bottom 0.5: D59.3 63.5,17.78 63.5,6.35
  Bottom 0.61: SV8.1 78.74,1.91 78.74,6.35 63.5,6.35
LED52
  Bottom 0.5: D60.3 64.77,15.24 64.77,7.62
  Bottom 0.61: SV8.2 80.01,7.62 64.77,7.62
LED53
  Bottom 0.5: 68.75,8.89 D61.3
  Bottom 0.61: SV8.3 81.28,1.91 81.28,8.89 68.75,8.89
LED54
  Bottom 0.5: SV8.4 82.55,11.43 104.78,11.43 104.78,13.97 D62.3
LED55
  Bottom 0.5: 83.82,1.91 83.82,10.48 106.05,10.48 106.05,16.51 D63.3
  Bottom 0.61: SV8.5 83.82,1.91
LED56
  Bottom 0.5: SV8.6 85.09,9.53 107.31,9.53 107.31,19.05 D64.3
LED57
  Bottom 0.5: 108.58,21.59 D65.3
  Bottom 0.61: SV8.7 86.36,1.91 86.36,8.57 108.58,8.57 108.58,21.59
LED58
  Bottom 0.5: 109.86,24.13 D66.3
  Bottom 0.61: SV8.8 87.63,7.62 109.86,7.62 109.86,24.13
LED59
  Bottom 0.5: 111.12,26.67 D67.3
  Bottom 0.61: SV8.9 88.9,1.91 88.9,6.67 111.12,6.67 111.12,26.67
LED60
  Bottom 0.5: 112.39,29.21 D68.3
  Bottom 0.61: SV8.10 112.39,4.45 112.39,29.21
MOD2_OUT0
  Bottom 0.5: D9.1 99.23,68.58 MOD2.!OUT0 R9.2
MOD2_OUT1
  Bottom 0.5: D10.1 102.41,71.12 MOD2.!OUT1 R10.2
MOD2_OUT2
  Bottom 0.5: D11.1 99.23,73.66 MOD2.!OUT2 R11.2
MOD2_OUT3
  Bottom 0.5: R12.2 MOD2.!OUT3 102.41,76.2 D12.1
MOD2_OUT4
  Bottom 0.5: D13.1 99.23,78.74 MOD2.!OUT4 R13.2
MOD2_OUT5
  Bottom 0.5: D14.1 102.41,81.28 MOD2.!OUT5 R14.2
MOD2_OUT6
  Bottom 0.5: D15.1 99.23,83.82 MOD2.!OUT6 | MOD2.!OUT6 95.89,83.82 | R15.2 MOD2.!OUT6
MOD2_OUT7
  Bottom 0.5: D16.1 102.41,86.36 MOD2.!OUT7 R16.2
MOD2_OUT8
  Bottom 0.5: D17.1 70.95,86.36 MOD2.!OUT8 R17.2
MOD2_OUT9
  Bottom 0.5: D18.1 67.78,83.82 MOD2.!OUT9 R18.2
MOD2_OUT10
  Bottom 0.5: D19.1 70.95,81.28 MOD2.!OUT10 R19.2
MOD2_OUT11
  Bottom 0.5: D20.1 67.78,78.74 MOD2.!OUT11+ R20.2
MOD2_OUT12
  Bottom 0.5: D21.1 70.95,76.2 MOD2.!OUT12 R21.2
MOD2_OUT13
  Bottom 0.5: D22.1 67.78,73.66 MOD2.!OUT13 R22.2
MOD2_OUT14
  Bottom 0.5: D23.1 70.95,71.12 MOD2.!OUT14 R23.2
MOD3_OUT0
  Bottom 0.5: D24.1 43.35,68.58 MOD3.!OUT0 R24.2
MOD3_OUT1
  Bottom 0.5: D25.1 46.52,71.12 MOD3.!OUT1 R25.2
MOD3_OUT2
  Bottom 0.5: D26.1 43.35,73.66 MOD3.!OUT2 R26.2
MOD3_OUT3
  Bottom 0.5: D27.1 46.52,76.2 MOD3.!OUT3 R27.2
MOD3_OUT4
  Bottom 0.5: D28.1 43.35,78.74 MOD3.!OUT4 R28.2
MOD3_OUT5
  Bottom 0.5: D29.1 46.52,81.28 MOD3.!OUT5 R29.2
MOD3_OUT6
  Bottom 0.5: D30.1 43.35,83.82 MOD3.!OUT6 R30.2
MOD3_OUT7
  Bottom 0.5: D31.1 46.52,86.36 MOD3.!OUT7 R31.2
MOD3_OUT8
  Bottom 0.5: D32.1 15.07,86.36 MOD3.!OUT8 R32.2
MOD3_OUT9
  Bottom 0.5: D33.1 11.89,83.82 MOD3.!OUT9 R33.2
MOD3_OUT10
  Bottom 0.5: D34.1 15.07,81.28 MOD3.!OUT10 R34.2
MOD3_OUT11
  Bottom 0.5: D35.1 11.89,78.74 MOD3.!OUT11+ R35.2
MOD3_OUT12
  Bottom 0.5: D36.1 15.07,76.2 MOD3.!OUT12 R36.2
MOD3_OUT13
  Bottom 0.5: D37.1 11.89,73.66 MOD3.!OUT13 R37.2
MOD3_OUT14
  Bottom 0.5: D38.1 15.07,71.12 MOD3.!OUT14 R38.2
MOD4_OUT0
  Bottom 0.5: D39.1 11.89,31.11 MOD4.!OUT0 R39.2
MOD4_OUT1
  Bottom 0.5: D40.1 15.07,28.57 MOD4.!OUT1 R40.2
MOD4_OUT2
  Bottom 0.5: D41.1 11.89,26.04 MOD4.!OUT2 R41.2
MOD4_OUT3
  Bottom 0.5: D42.1 15.07,23.5 MOD4.!OUT3 R42.2
MOD4_OUT4
  Bottom 0.5: D43.1 11.89,20.95 MOD4.!OUT4 R43.2
MOD4_OUT5
  Bottom 0.5: D44.1 15.07,18.41 MOD4.!OUT5 R44.2
MOD4_OUT6
  Bottom 0.5: D45.1 11.89,15.88 MOD4.!OUT6 R45.2
MOD4_OUT7
  Bottom 0.5: D46.1 15.07,13.34 MOD4.!OUT7 R46.2
MOD4_OUT8
  Bottom 0.5: D47.1 43.35,13.34 MOD4.!OUT8 R47.2
MOD4_OUT9
  Bottom 0.5: D48.1 46.52,15.88 MOD4.!OUT9 R48.2
MOD4_OUT10
  Bottom 0.5: D49.1 43.35,18.41 MOD4.!OUT10 R49.2
MOD4_OUT11
  Bottom 0.5: D50.1 46.52,20.95 MOD4.!OUT11+ R50.2
MOD4_OUT12
  Bottom 0.5: D51.1 43.35,23.5 MOD4.!OUT12 R51.2
MOD4_OUT13
  Bottom 0.5: D52.1 46.52,26.04 MOD4.!OUT13 R52.2
MOD4_OUT14
  Bottom 0.5: D53.1 43.35,28.57 MOD4.!OUT14 R53.2
MOD5_OUT0
  Bottom 0.5: D54.1 67.78,31.11 MOD5.!OUT0 R54.2
MOD5_OUT1
  Bottom 0.5: D55.1 70.95,28.57 MOD5.!OUT1 R55.2
MOD5_OUT2
  Bottom 0.5: D56.1 67.78,26.04 MOD5.!OUT2 R56.2
MOD5_OUT3
  Bottom 0.5: D57.1 70.95,23.5 MOD5.!OUT3 R57.2
MOD5_OUT4
  Bottom 0.5: D58.1 67.78,20.95 MOD5.!OUT4 R58.2
MOD5_OUT5
  Bottom 0.5: D59.1 70.95,18.41 MOD5.!OUT5 R59.2
MOD5_OUT6
  Bottom 0.5: D60.1 67.78,15.88 MOD5.!OUT6 R60.2
MOD5_OUT7
  Bottom 0.5: D61.1 70.95,13.34 MOD5.!OUT7 R61.2
MOD5_OUT8
  Bottom 0.5: D62.1 99.23,13.34 MOD5.!OUT8 R62.2
MOD5_OUT9
  Bottom 0.5: D63.1 102.41,15.88 MOD5.!OUT9 | MOD5.!OUT9 95.89,15.88 | R63.2 MOD5.!OUT9
MOD5_OUT10
  Bottom 0.5: D64.1 99.23,18.41 MOD5.!OUT10 R64.2
MOD5_OUT11
  Bottom 0.5: D65.1 102.41,20.95 MOD5.!OUT11+ R65.2
MOD5_OUT12
  Bottom 0.5: D66.1 99.23,23.5 MOD5.!OUT12 R66.2
MOD5_OUT13
  Bottom 0.5: D67.1 102.41,26.04 MOD5.!OUT13 R67.2
MOD5_OUT14
  Bottom 0.5: D68.1 99.23,28.57 MOD5.!OUT14 R68.2
RX
  Bottom 0.61: IC3.1 151.13,72.39 151.13,44.45 MOD1.P$9
S_SEG0
  Bottom 0.5: D1.1 119.55,49.53 MOD1.P$41 R1.2
S_SEG1
  Bottom 0.5: R2.2 MOD1.P$43 119.55,54.61 D2.1
S_SEG2
  Bottom 0.5: D3.1 122.72,41.91 MOD1.P$38 R3.2
S_SEG3
  Bottom 0.5: D4.1 119.55,44.45 MOD1.P$39 R4.2
S_SEG4
  Bottom 0.5: D5.1 119.55,39.37 MOD1.P$37 R5.2
S_SEG5
  Bottom 0.5: D6.1 122.72,46.99 MOD1.P$40 R6.2
S_SEG6
  Bottom 0.5: D7.1 122.72,52.07 MOD1.P$42 R7.2
S_SEG7
  Bottom 0.5: D8.1 122.72,36.83 MOD1.P$36 R8.2
SCL
  Bottom 0.61: MOD5.SCL 86.36,37.78 54.61,37.78 54.61,45.09 30.48,45.09 MOD4.SCL 30.48,37.78 16.51,37.78 16.51,54.61 27.94,54.61 MOD3.SCL 27.94,61.91 49.53,61.91 49.53,54.61 83.82,54.61 MOD2.SCL 83.82,63.5 139.7,63.5 139.7,39.37 MOD1.P$7
SEG0
  Bottom 0.61: SV2.4 145.41,15.24 145.41,25.4 133.35,25.4 133.35,50.16 D1.3
SEG1
  Bottom 0.61: SV2.2 147.96,15.24 147.96,27.94 135.89,27.94 135.89,55.24 D2.3
SEG2
  Bottom 0.61: D3.3 129.54,42.55 129.54,21.59 141.6,21.59 SV2.5
SEG3
  Bottom 0.61: SV2.6 142.88,15.24 142.88,22.86 130.81,22.86 130.81,45.09 D4.3
SEG4
  Bottom 0.61: SV2.8 140.34,15.24 140.34,20.32 128.27,20.32 128.27,40.01 D5.3
SEG5
  Bottom 0.61: D6.3 132.08,47.62 132.08,24.13 144.15,24.13 SV2.3
SEG6
  Bottom 0.61: D7.3 134.62,52.7 134.62,26.67 146.69,26.67 SV2.1
SEG7
  Bottom 0.61: D8.3 127,37.47 127,19.05 139.06,19.05 SV2.7
SIMO0/SDA
  Bottom 0.61: MOD5.SDA 83.82,39.05 55.88,39.05 55.88,46.35 27.94,46.35 MOD4.SDA 27.94,39.05 17.78,39.05 17.78,53.34 30.48,53.34 MOD3.SDA 30.48,60.64 48.26,60.64 48.26,53.34 86.36,53.34 MOD2.SDA 86.36,60.96 138.43,60.96 138.43,34.29 MOD1.P$5
TX
  Bottom 0.61: IC2.4 137.16,68.58 137.16,66.04 142.24,66.04 142.24,41.91 MOD1.P$8

### Text on the board
Bottom: LED_Controll